# Altium project PCB_Project.PrjPcb (part 1 of 2)
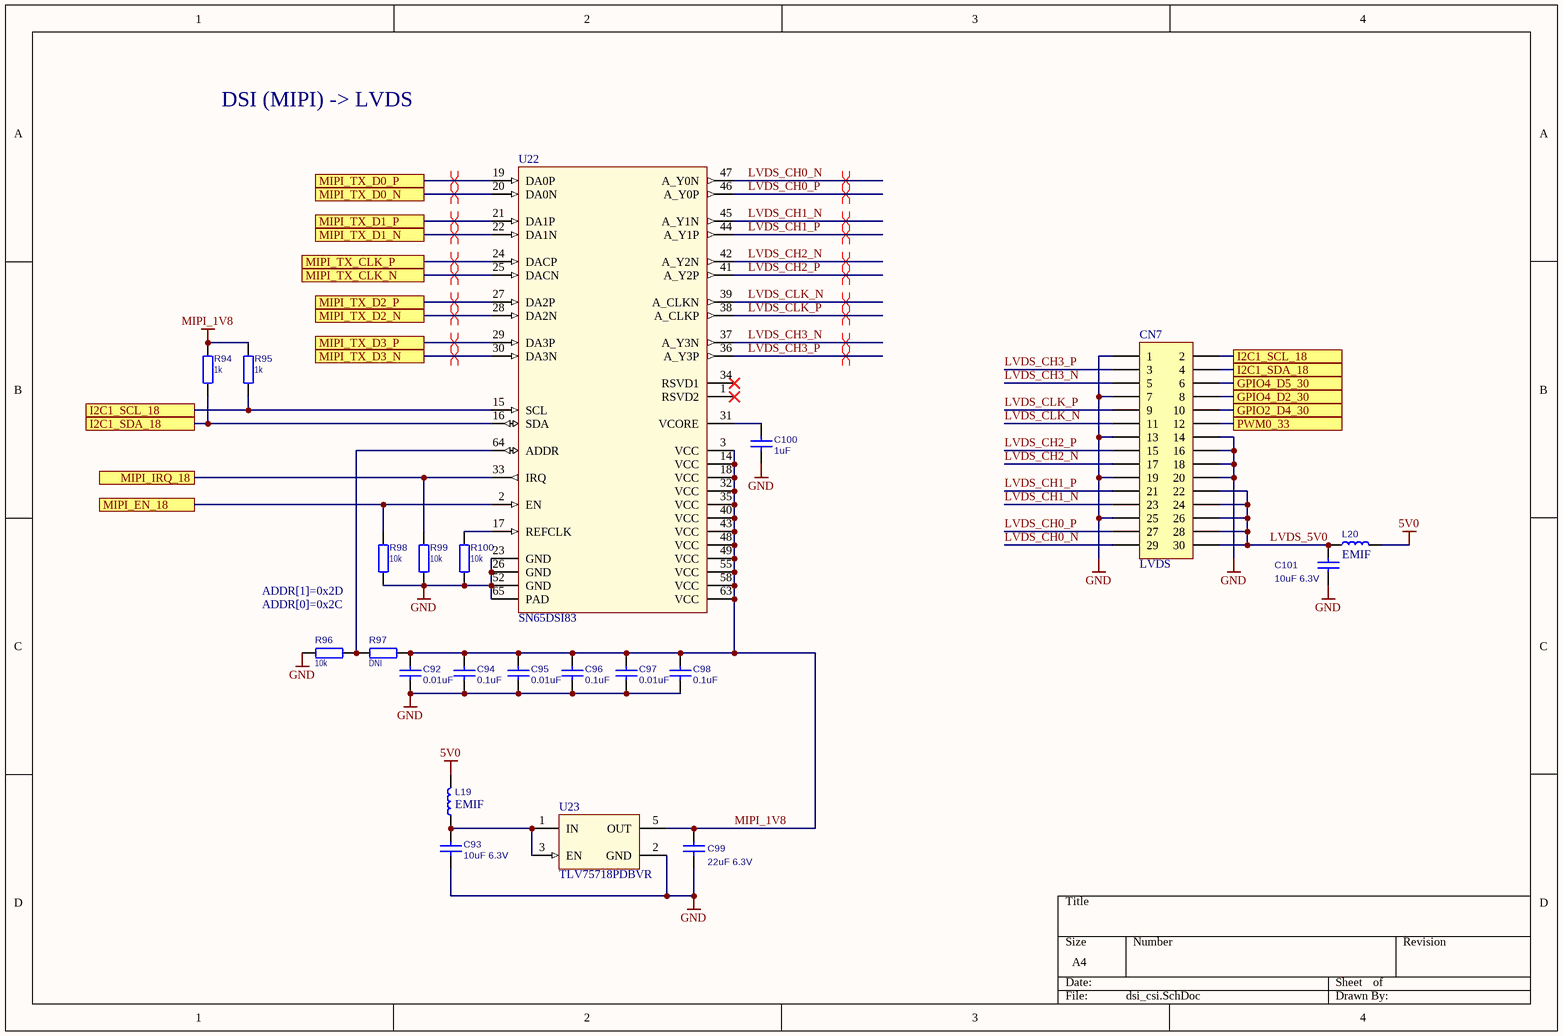
[diagram p0: dsi_csi.SchDoc]
10 sheets, 297 parts. Net scope: flat (ports and power ports of the same name join across sheets).
Board file: PCB.PcbDoc
Sheets:
  dsi_csi.SchDoc
  sdcard.SchDoc
  sensors.SchDoc
  audio.SchDoc
  connectivity.SchDoc
  usb.SchDoc
  debug.SchDoc
  hdmi.SchDoc
  power.SchDoc
  x3399.SchDoc

## Sheet dsi_csi.SchDoc
size A4

### Parts
C92  value 0.01uF  [C0603]  (hidden comment: CL10B103KB8NNNC)
C93  value 10uF 6.3V  [C0603]  (hidden comment: CC0603MRX5R5BB106)
C94  value 0.1uF  [C0603]  (hidden comment: C1608X7R1H104K080AA)
C95  value 0.01uF  [C0603]  (hidden comment: CL10B103KB8NNNC)
C96  value 0.1uF  [C0603]  (hidden comment: C1608X7R1H104K080AA)
C97  value 0.01uF  [C0603]  (hidden comment: CL10B103KB8NNNC)
C98  value 0.1uF  [C0603]  (hidden comment: C1608X7R1H104K080AA)
C99  value 22uF 6.3V  [C0805]  (hidden comment: CL21A226MQQNNNE)
C100  value 1uF  [C0603]  (hidden comment: GRM188R61H105KAALD)
C101  value 10uF 6.3V  [C0603]  (hidden comment: CC0603MRX5R5BB106)
CN7  LVDS  [DF13EA-30DP-1.25V]
L19  value EMIF  [IND0603]  (hidden comment: BLM18AG102SN1D)
L20  value EMIF  [IND0805]  (hidden comment: BLM21PG221SN1D)
R94  1k  [R0603]
R95  1k  [R0603]
R96  10k  [R0603]
R97  DNI  [R0603]
R98  10k  [R0603]
R99  10k  [R0603]
R100  10k  [R0603]
U22  SN65DSI83  [HPM064_N]
U23  TLV75718PDBVR  [SOT-23-5]

### Ports
GPIO2_D4_30, GPIO4_D2_30, GPIO4_D5_30, I2C1_SCL_18, I2C1_SDA_18, MIPI_EN_18, MIPI_IRQ_18, MIPI_TX_CLK_N, MIPI_TX_CLK_P, MIPI_TX_D0_N, MIPI_TX_D0_P, MIPI_TX_D1_N, MIPI_TX_D1_P, MIPI_TX_D2_N, MIPI_TX_D2_P, MIPI_TX_D3_N, MIPI_TX_D3_P, PWM0_33

### Nets
5V0: L19.2 L20.1
GND: C92.2 C93.2 C94.1 C95.2 C96.1 C97.2 C98.1 C99.1 C100.1 C101.2 CN7.1 CN7.7 CN7.13 CN7.14 CN7.16 CN7.18 CN7.19 CN7.20 CN7.25 R96.1 R98.1 R99.1 R100.1 U22.23(GND) U22.26(GND) U22.52(GND) U22.65(PAD) U23.2(GND)
MIPI_1V8: C92.1 C94.2 C95.1 C96.2 C97.1 C98.2 C99.2 R94.1 R95.1 R97.2 U22.3(VCC) U22.14(VCC) U22.18(VCC) U22.32(VCC) U22.35(VCC) U22.40(VCC) U22.43(VCC) U22.48(VCC) U22.49(VCC) U22.55(VCC) U22.58(VCC) U22.63(VCC) U23.5(OUT)
GPIO2_D4_30: CN7.10 ; port GPIO2_D4_30
GPIO4_D2_30: CN7.8 ; port GPIO4_D2_30
GPIO4_D5_30: CN7.6 ; port GPIO4_D5_30
I2C1_SCL_18: CN7.2 R95.2 U22.15(SCL) ; port I2C1_SCL_18
I2C1_SDA_18: CN7.4 R94.2 U22.16(SDA) ; port I2C1_SDA_18
LVDS_5V0: C101.1 CN7.22 CN7.24 CN7.26 CN7.28 CN7.30 L20.2
LVDS_CH0_N: CN7.29 U22.47(A_Y0N)
LVDS_CH0_P: CN7.27 U22.46(A_Y0P)
LVDS_CH1_N: CN7.23 U22.45(A_Y1N)
LVDS_CH1_P: CN7.21 U22.44(A_Y1P)
LVDS_CH2_N: CN7.17 U22.42(A_Y2N)
LVDS_CH2_P: CN7.15 U22.41(A_Y2P)
LVDS_CH3_N: CN7.5 U22.37(A_Y3N)
LVDS_CH3_P: CN7.3 U22.36(A_Y3P)
LVDS_CLK_N: CN7.11 U22.39(A_CLKN)
LVDS_CLK_P: CN7.9 U22.38(A_CLKP)
MIPI_EN_18: R98.2 U22.2(EN) ; port MIPI_EN_18
MIPI_IRQ_18: R99.2 U22.33(IRQ) ; port MIPI_IRQ_18
MIPI_TX_CLK_N: U22.25(DACN) ; port MIPI_TX_CLK_N
MIPI_TX_CLK_P: U22.24(DACP) ; port MIPI_TX_CLK_P
MIPI_TX_D0_N: U22.20(DA0N) ; port MIPI_TX_D0_N
MIPI_TX_D0_P: U22.19(DA0P) ; port MIPI_TX_D0_P
MIPI_TX_D1_N: U22.22(DA1N) ; port MIPI_TX_D1_N
MIPI_TX_D1_P: U22.21(DA1P) ; port MIPI_TX_D1_P
MIPI_TX_D2_N: U22.28(DA2N) ; port MIPI_TX_D2_N
MIPI_TX_D2_P: U22.27(DA2P) ; port MIPI_TX_D2_P
MIPI_TX_D3_N: U22.30(DA3N) ; port MIPI_TX_D3_N
MIPI_TX_D3_P: U22.29(DA3P) ; port MIPI_TX_D3_P
PWM0_33: CN7.12 ; port PWM0_33
NetC93_1: C93.1 L19.1 U23.1(IN) U23.3(EN)
NetC100_2: C100.2 U22.31(VCORE)
NetR96_2: R96.2 R97.1 U22.64(ADDR)
NetR100_2: R100.2 U22.17(REFCLK)

Not connected (* = marked no-connect by the designer): U22 1(RSVD2)* 34(RSVD1)*

### Layout directives
differential pair: LVDS_CH0_N, LVDS_CH0_P, LVDS_CH1_N, LVDS_CH1_P, LVDS_CH2_N, LVDS_CH2_P, LVDS_CH3_N, LVDS_CH3_P, LVDS_CLK_N, LVDS_CLK_P, MIPI_TX_CLK_N, MIPI_TX_CLK_P, MIPI_TX_D0_N, MIPI_TX_D0_P, MIPI_TX_D1_N, MIPI_TX_D1_P, MIPI_TX_D2_N, MIPI_TX_D2_P, MIPI_TX_D3_N, MIPI_TX_D3_P

### Notes on the sheet
- DSI (MIPI) -> LVDS
- ADDR[1]=0x2D
- ADDR[0]=0x2C

### Library data of the parts
C92-C101 = CAP_NPOL
CN7 = HDR 15X2: Header, 15-Pin, Dual row; LatestRevisionDate: 17-Jul-2002; LatestRevisionNote: Re-released for DXP Platform.; Publisher: Altium Limited
L19 L20 = IND_WO_IRON
R94-R100 = RESISTOR: RES
  R94 R95: Value: 1k
  R96 R98-R100: Value: 10k
  R97: Value: DNI
U22 = SN65DSI83: Single-Channel MIPI® DSI to Single-Link LVDS Bridge; value: SN65DSI83
U23 = TLV733P: Capacitor-Free, 300-mA, Low-Dropout Regulator with Foldback Current Limit for Portable Devices; value: TLV733P

## Sheet sdcard.SchDoc
size A4
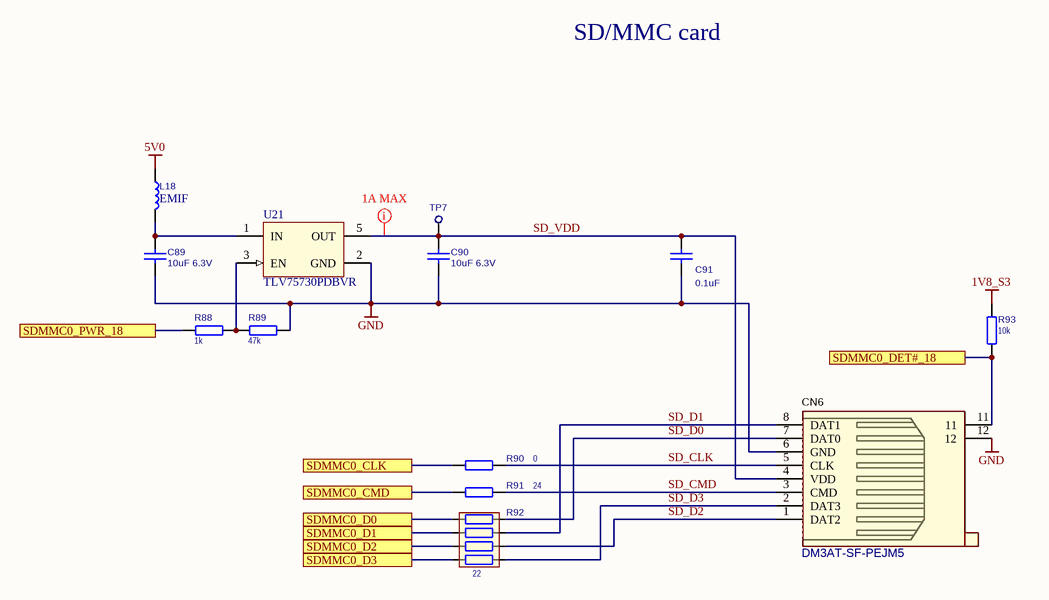
[diagram p1: sdcard.SchDoc]

### Parts
C89  value 10uF 6.3V  [C0603]  (hidden comment: CC0603MRX5R5BB106)
C90  value 10uF 6.3V  [C0603]  (hidden comment: CC0603MRX5R5BB106)
C91  value 0.1uF  [C0603]  (hidden comment: C1608X7R1H104K080AA)
CN6  DM3AT-SF-PEJM5  [mSD_TF_push]
L18  value EMIF  [IND0603]  (hidden comment: BLM18AG102SN1D)
R88  1k  [R0603]
R89  47k  [R0603]
R90  0  [R0603]
R91  value 24  [R0603]  (hidden comment: 22)
R92  value 22  [R0804X4]  (hidden comment: TC124-JR-0722RL)
R93  10k  [R0603]
TP7  TEST-POINT  [PAD]  (value not drawn)
U21  TLV75730PDBVR  [SOT-23-5]

### Ports
SDMMC0_CLK, SDMMC0_CMD, SDMMC0_D0, SDMMC0_D1, SDMMC0_D2, SDMMC0_D3, SDMMC0_DET#_18, SDMMC0_PWR_18

### Nets
1V8_S3: R93.2
5V0: L18.1
GND: C89.2 C90.2 C91.1 CN6.6(GND) CN6.12 R89.2 U21.2(GND)
SD_CLK: CN6.5(CLK) R90.1
SD_CMD: CN6.3(CMD) R91.1
SD_D0: CN6.7(DAT0) R92.2
SD_D1: CN6.8(DAT1) R92.4
SD_D2: CN6.1(DAT2) R92.6
SD_D3: CN6.2(DAT3) R92.8
SD_VDD: C90.1 C91.2 CN6.4(VDD) TP7.1 U21.5(OUT)
SDMMC0_CLK: R90.2 ; port SDMMC0_CLK
SDMMC0_CMD: R91.2 ; port SDMMC0_CMD
SDMMC0_D0: R92.1 ; port SDMMC0_D0
SDMMC0_D1: R92.3 ; port SDMMC0_D1
SDMMC0_D2: R92.5 ; port SDMMC0_D2
SDMMC0_D3: R92.7 ; port SDMMC0_D3
SDMMC0_DET#_18: CN6.11 R93.1 ; port SDMMC0_DET#_18
SDMMC0_PWR_18: R88.1 ; port SDMMC0_PWR_18
NetC89_1: C89.1 L18.2 U21.1(IN)
NetR88_2: R88.2 R89.1 U21.3(EN)

### Layout directives
mark named 1A MAX: SD_VDD

### Notes on the sheet
- SD/MMC card

### Library data of the parts
C89-C91 = CAP_NPOL
CN6 = uSD card socket: In Stock: 0; Type: Connectors; Price: 0.00; Supplier: Rusar; Supplier PN: xxx
L18 = IND_WO_IRON
R88-R91 R93 = RESISTOR: RES
  R88: Value: 1k
  R89: Value: 47k
  R90: Value: 0
  R93: Value: 10k
R92 = ARRAY
TP7 = TEST-POINT: PCB terminal block; Value: *
U21 = TLV733P: as U23 on sheet dsi_csi; value: TLV733P

## Sheet sensors.SchDoc
size A4
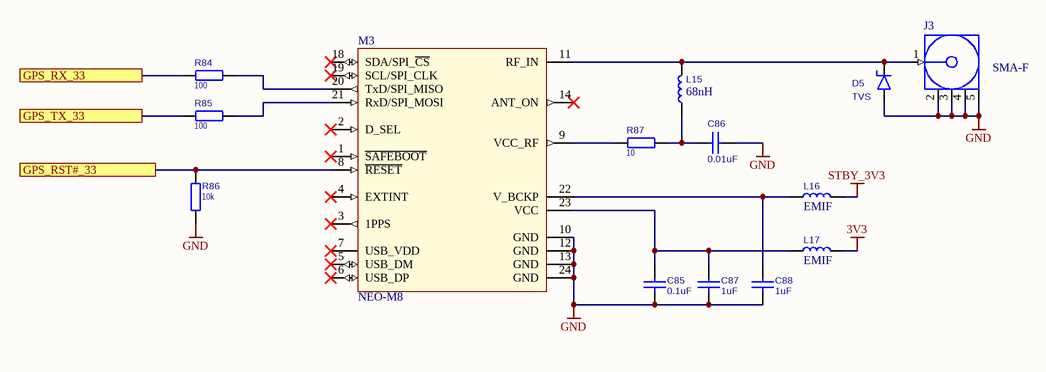
[diagram p2: sensors.SchDoc]

### Parts
C85  value 0.1uF  [C0603]  (hidden comment: C1608X7R1H104K080AA)
C86  value 0.01uF  [C0603]  (hidden comment: CL10B103KB8NNNC)
C87  value 1uF  [C0603]  (hidden comment: GRM188R61H105KAALD)
C88  value 1uF  [C0603]  (hidden comment: GRM188R61H105KAALD)
D5  value TVS  [SOD-323]  (hidden comment: CDSOD323-T05LC)
J3  value SMA-F  [MCX5.08-H5]  (hidden comment: CON SMA-F S-037-TGG R/A PCB)
L15  value 68nH  [IND0603]  (hidden comment: CLH1608T-68NJ-S)
L16  value EMIF  [IND0603]  (hidden comment: BLM18AG102SN1D)
L17  value EMIF  [IND0805]  (hidden comment: BLM21PG221SN1D)
M3  NEO-M8  [NEO-M8N]
R84  100  [R0603]
R85  100  [R0603]
R86  10k  [R0603]
R87  10  [R0603]

### Ports
GPS_RST#_33, GPS_RX_33, GPS_TX_33

### Nets
3V3: L17.1
GND: C85.2 C86.1 C87.1 C88.1 D5.1(A) J3.2(GND) J3.3(GND) J3.4(GND) J3.5(GND) M3.10(GND) M3.12(GND) M3.13(GND) M3.24(GND) R86.2
STBY_3V3: L16.2
GPS_RST#_33: M3.8(~{RESET}) R86.1 ; port GPS_RST#_33
GPS_RX_33: R84.1 ; port GPS_RX_33
GPS_TX_33: R85.1 ; port GPS_TX_33
NetC85_1: C85.1 C87.2 L17.2 M3.23(VCC)
NetC86_2: C86.2 L15.1 R87.2
NetC88_2: C88.2 L16.1 M3.22(V_BCKP)
NetD5_2: D5.2(K) J3.1(Signal) L15.2 M3.11(RF_IN)
NetM3_9: M3.9(VCC_RF) R87.1
NetM3_20: M3.20(TxD/SPI_MISO) R84.2
NetM3_21: M3.21(RxD/SPI_MOSI) R85.2

Not connected (* = marked no-connect by the designer): M3 1(~{SAFEBOOT})* 2(D_SEL)* 3(1PPS)* 4(EXTINT)* 5(USB_DM)* 6(USB_DP)* 7(USB_VDD)* 14(ANT_ON)* 18(SDA/SPI_~{CS})* 19(SCL/SPI_CLK)*

### Library data of the parts
C85-C88 = CAP_NPOL
D5 = ZENNER_1: TVS Diode
J3 = COAX-F: RF Coaxial PCB Connector, MCX; Thru-Hole, Right-Angle Mount Socket, Blunt Post Terminal, 50 Ohm Impedance; PCB_Layout: Complies with manufacturer's recommendation.; DrillSize: Corresponds to nominal value.; Published: 15-Jul-2004; LatestRevisionDate: 15-Jul-2004; LatestRevisionNote: Component Replaced.; DatasheetDocument: 30-May-2003; PackageDocument: 04-Jul-1999; PackageReference: 919-119J-51AX; Publisher: Altium Limited; ComponentLink1Description: Manufacturer Link; ComponentLink1URL: http://www.amphenolrf.com/
L15-L17 = IND_WO_IRON
M3 = NEO-M8: NEO-M8 concurrent GNSS modules; value: NEO-M8
R84-R87 = RESISTOR: RES
  R84 R85: Value: 100
  R86: Value: 10k
  R87: Value: 10

## Sheet audio.SchDoc
size A3
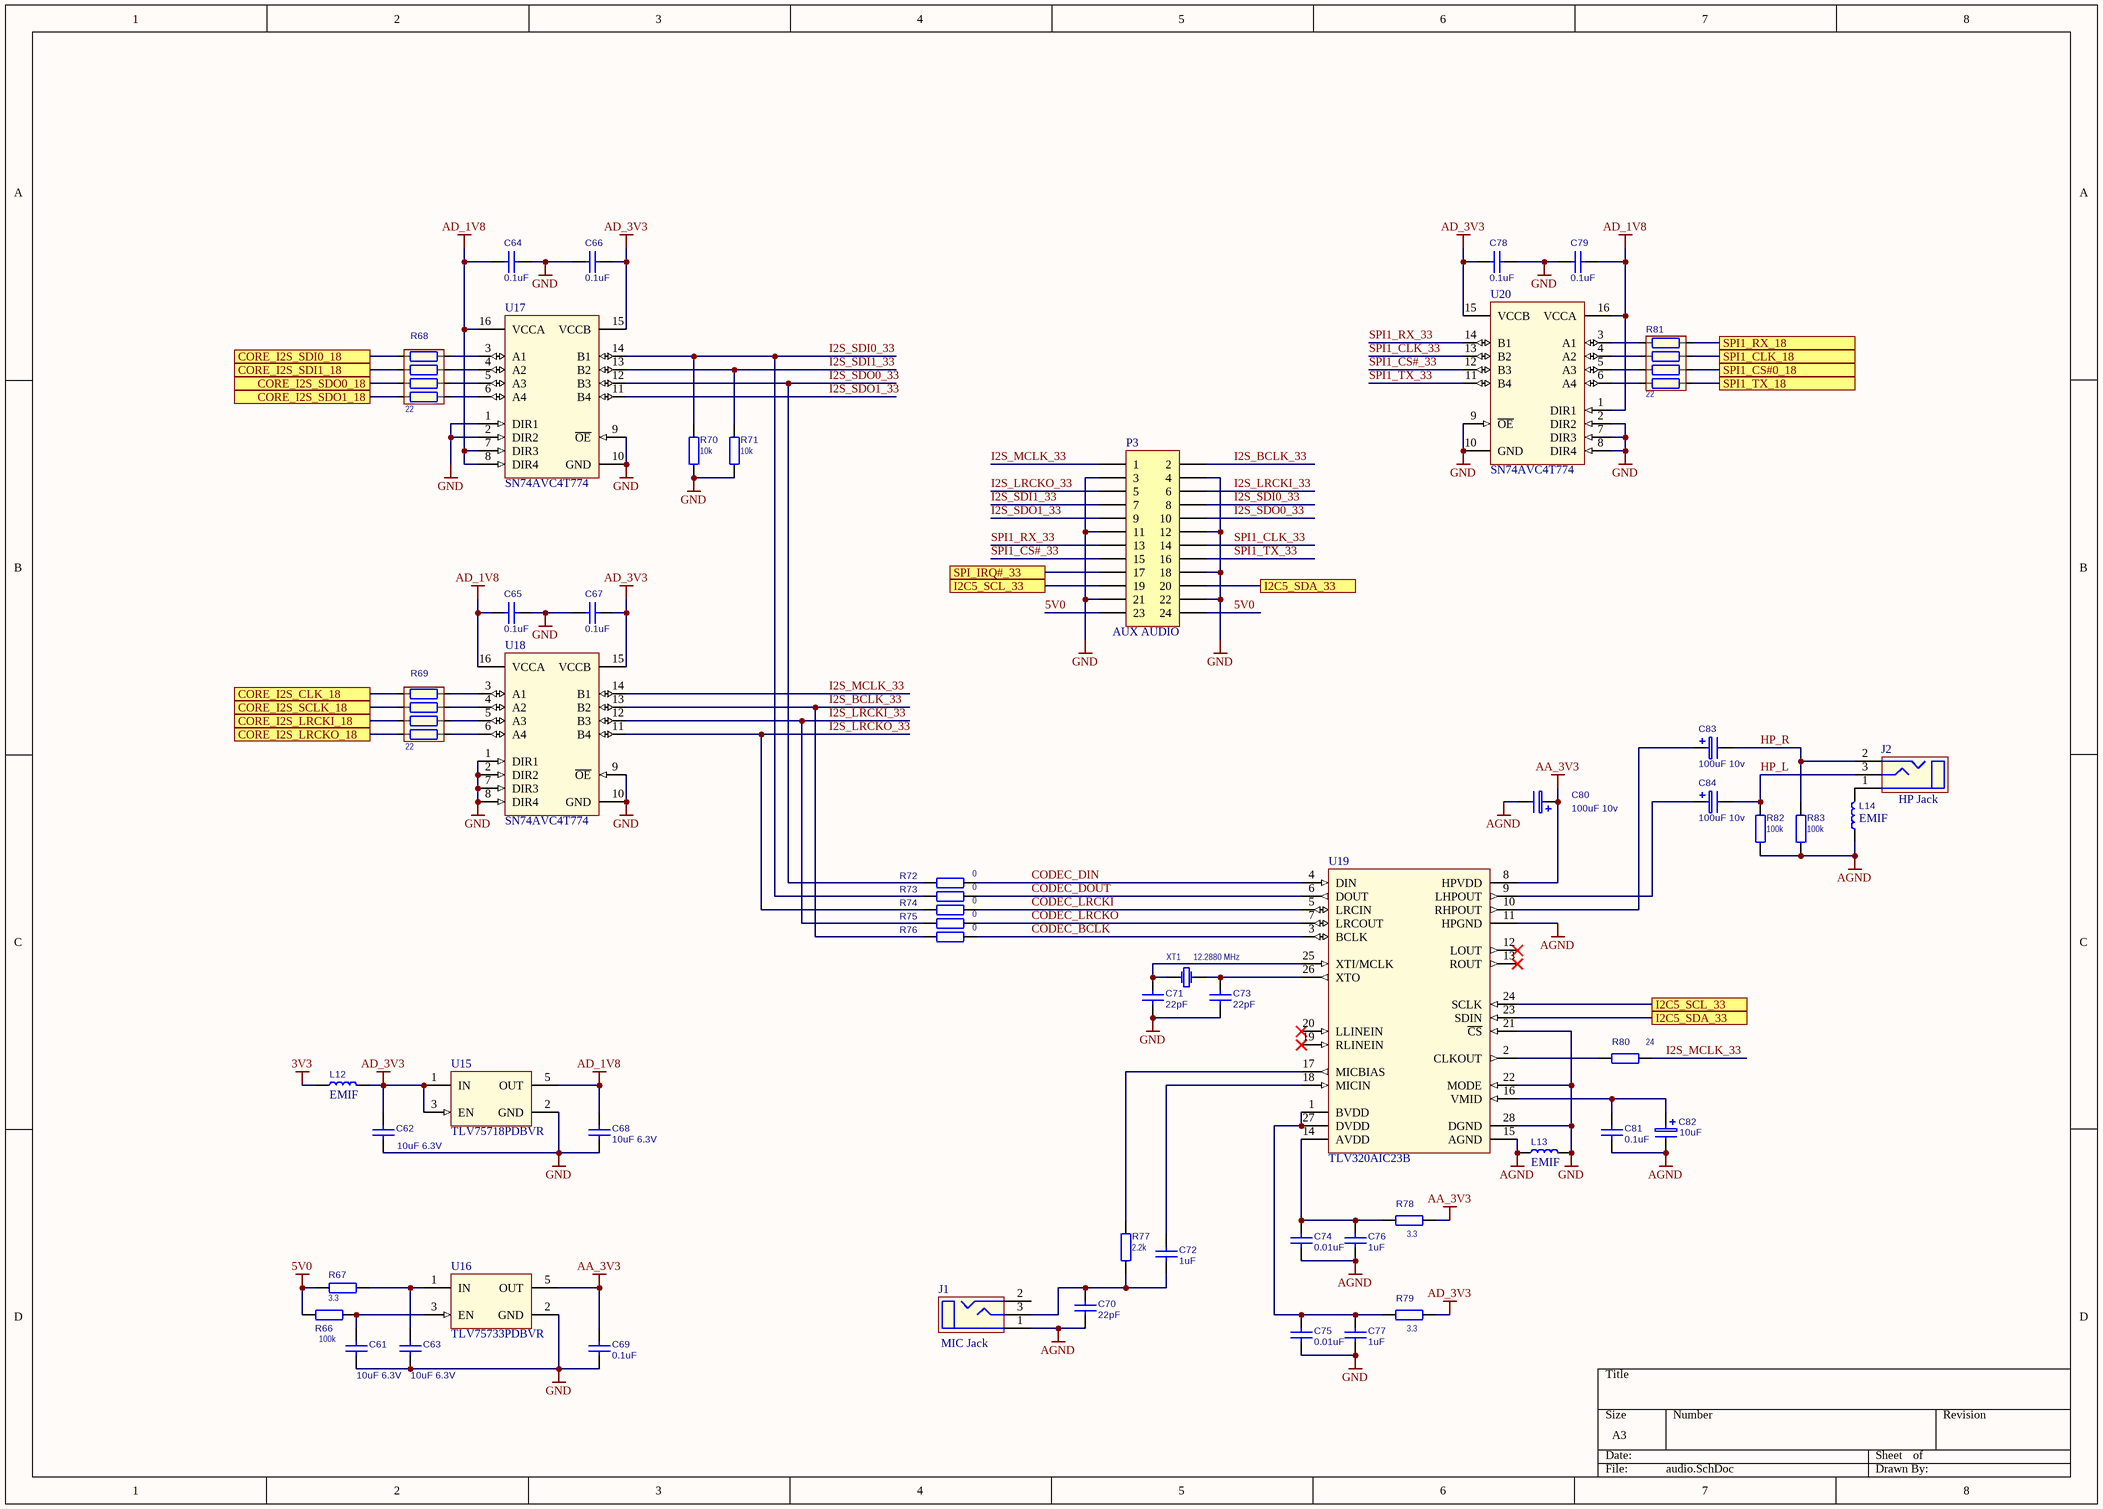
[diagram p3: audio.SchDoc]

### Parts
C61  value 10uF 6.3V  [C0603]  (hidden comment: CC0603MRX5R5BB106)
C62  value 10uF 6.3V  [C0603]  (hidden comment: CC0603MRX5R5BB106)
C63  value 10uF 6.3V  [C0603]  (hidden comment: CC0603MRX5R5BB106)
C64  value 0.1uF  [C0603]  (hidden comment: C1608X7R1H104K080AA)
C65  value 0.1uF  [C0603]  (hidden comment: C1608X7R1H104K080AA)
C66  value 0.1uF  [C0603]  (hidden comment: C1608X7R1H104K080AA)
C67  value 0.1uF  [C0603]  (hidden comment: C1608X7R1H104K080AA)
C68  value 10uF 6.3V  [C0603]  (hidden comment: CC0603MRX5R5BB106)
C69  value 0.1uF  [C0603]  (hidden comment: C1608X7R1H104K080AA)
C70  22pF  [C0603]
C71  22pF  [C0603]
C72  value 1uF  [C0603]  (hidden comment: GRM188R61H105KAALD)
C73  22pF  [C0603]
C74  value 0.01uF  [C0603]  (hidden comment: C1608X7R1H104K080AA)
C75  value 0.01uF  [C0603]  (hidden comment: C1608X7R1H104K080AA)
C76  value 1uF  [C0603]  (hidden comment: GRM188R61H105KAALD)
C77  value 1uF  [C0603]  (hidden comment: GRM188R61H105KAALD)
C78  value 0.1uF  [C0603]  (hidden comment: C1608X7R1H104K080AA)
C79  value 0.1uF  [C0603]  (hidden comment: C1608X7R1H104K080AA)
C80  value 100uF 10v  [R06H11]  (hidden comment: SH010M0100B2F-0511)
C81  value 0.1uF  [C0603]  (hidden comment: C1608X7R1H104K080AA)
C82  value 10uF  [TANTAL-A-1206]  (hidden comment: CAP_POL)
C83  value 100uF 10v  [R06H11]  (hidden comment: SH010M0100B2F-0511)
C84  value 100uF 10v  [R06H11]  (hidden comment: SH010M0100B2F-0511)
J1  value MIC Jack  [AUB-13]  (hidden comment: AUB-13)
J2  value HP Jack  [AUB-13]  (hidden comment: AUB-13)
L12  value EMIF  [IND0805]  (hidden comment: BLM21PG221SN1D)
L13  value EMIF  [IND0805]  (hidden comment: BLM21PG221SN1D)
L14  value EMIF  [IND0805]  (hidden comment: BLM21PG221SN1D)
P3  AUX AUDIO  [PLD-12]
R66  100k  [R0603]
R67  3.3  [R1206]
R68  value 22  [R0804X4]  (hidden comment: TC124-JR-0722RL)
R69  value 22  [R0804X4]  (hidden comment: TC124-JR-0722RL)
R70  10k  [R0603]
R71  10k  [R0603]
R72  0  [R0603]
R73  0  [R0603]
R74  0  [R0603]
R75  0  [R0603]
R76  0  [R0603]
R77  2.2k  [R0603]
R78  3.3  [R1206]
R79  3.3  [R1206]
R80  value 24  [R0603]  (hidden comment: 22)
R81  value 22  [R0804X4]  (hidden comment: TC124-JR-0722RL)
R82  100k  [R0603]
R83  100k  [R0603]
U15  TLV75718PDBVR  [SOT-23-5]
U16  TLV75733PDBVR  [SOT-23-5]
U17  SN74AVC4T774  [TSSOP-16]
U18  SN74AVC4T774  [TSSOP-16]
U19  TLV320AIC23B  [TSSOP-28]
U20  SN74AVC4T774  [TSSOP-16]
XT1  value 12.2880 MHz  [HC-49/S]  (hidden comment: KX-3H 12.2880 MHz)

### Ports
CORE_I2S_CLK_18, CORE_I2S_LRCKI_18, CORE_I2S_LRCKO_18, CORE_I2S_SCLK_18, CORE_I2S_SDI0_18, CORE_I2S_SDI1_18, CORE_I2S_SDO0_18, CORE_I2S_SDO1_18, I2C5_SCL_33, I2C5_SDA_33, SPI1_CLK_18, SPI1_CS#0_18, SPI1_RX_18, SPI1_TX_18, SPI_IRQ#_33

### Nets
3V3: L12.2
5V0: P3.23 P3.24 R66.1 R67.2
AA_3V3: C69.1 C80.1(+) R78.1 U16.5(OUT) U19.8(HPVDD)
AD_1V8: C64.2 C65.2 C68.1 C79.2 U15.5(OUT) U17.7(DIR3) U17.8(DIR4) U17.16(VCCA) U18.16(VCCA) U20.1(DIR1) U20.16(VCCA)
AD_3V3: C62.1 C66.1 C67.1 C78.1 L12.1 R79.1 U15.1(IN) U15.3(EN) U17.15(VCCB) U18.15(VCCB) U20.15(VCCB)
AGND: C70.2 C74.2 C76.1 C80.2(-) C81.2 C82.2(-) J1.1(C) L13.2 L14.2 R82.2 R83.2 U19.11(HPGND) U19.15(AGND)
GND: C61.2 C62.2 C63.2 C64.1 C65.1 C66.2 C67.2 C68.2 C69.2 C71.1 C73.1 C75.2 C77.1 C78.2 C79.1 L13.1 P3.3 P3.4 P3.11 P3.12 P3.18 P3.21 P3.22 R70.2 R71.2 U15.2(GND) U16.2(GND) U17.1(DIR1) U17.2(DIR2) U17.9(~{OE}) U17.10(GND) U18.1(DIR1) U18.2(DIR2) U18.7(DIR3) U18.8(DIR4) U18.9(~{OE}) U18.10(GND) U19.21(~{CS}) U19.22(MODE) U19.28(DGND) U20.2(DIR2) U20.7(DIR3) U20.8(DIR4) U20.9(~{OE}) U20.10(GND)
CODEC_BCLK: R76.2 U19.3(BCLK)
CODEC_DIN: R72.2 U19.4(DIN)
CODEC_DOUT: R73.2 U19.6(DOUT)
CODEC_LRCKI: R74.2 U19.5(LRCIN)
CODEC_LRCKO: R75.2 U19.7(LRCOUT)
CORE_I2S_CLK_18: R69.1 ; port CORE_I2S_CLK_18
CORE_I2S_LRCKI_18: R69.5 ; port CORE_I2S_LRCKI_18
CORE_I2S_LRCKO_18: R69.7 ; port CORE_I2S_LRCKO_18
CORE_I2S_SCLK_18: R69.3 ; port CORE_I2S_SCLK_18
CORE_I2S_SDI0_18: R68.1 ; port CORE_I2S_SDI0_18
CORE_I2S_SDI1_18: R68.3 ; port CORE_I2S_SDI1_18
CORE_I2S_SDO0_18: R68.5 ; port CORE_I2S_SDO0_18
CORE_I2S_SDO1_18: R68.7 ; port CORE_I2S_SDO1_18
HP_L: C84.2(-) J2.3(L) R82.1
HP_R: C83.2(-) J2.2(R) R83.1
I2C5_SCL_33: P3.19 U19.24(SCLK) ; port I2C5_SCL_33
I2C5_SDA_33: P3.20 U19.23(SDIN) ; port I2C5_SDA_33
I2S_BCLK_33: P3.2 R76.1 U18.13(B2)
I2S_LRCKI_33: P3.6 R75.1 U18.12(B3)
I2S_LRCKO_33: P3.5 R74.1 U18.11(B4)
I2S_MCLK_33: P3.1 R80.1 U18.14(B1)
I2S_SDI0_33: P3.8 R70.1 R73.1 U17.14(B1)
I2S_SDI1_33: P3.7 R71.1 U17.13(B2)
I2S_SDO0_33: P3.10 R72.1 U17.12(B3)
I2S_SDO1_33: P3.9 U17.11(B4)
SPI1_CLK_18: R81.3 ; port SPI1_CLK_18
SPI1_CLK_33: P3.14 U20.13(B2)
SPI1_CS#0_18: R81.5 ; port SPI1_CS#0_18
SPI1_CS#_33: P3.15 U20.12(B3)
SPI1_RX_18: R81.1 ; port SPI1_RX_18
SPI1_RX_33: P3.13 U20.14(B1)
SPI1_TX_18: R81.7 ; port SPI1_TX_18
SPI1_TX_33: P3.16 U20.11(B4)
SPI_IRQ#_33: P3.17 ; port SPI_IRQ#_33
NetC61_1: C61.1 R66.2 U16.3(EN)
NetC63_1: C63.1 R67.1 U16.1(IN)
NetC70_1: C70.1 C72.2 J1.3(L) R77.2
NetC71_2: C71.2 U19.25(XTI/MCLK) XT1.1
NetC72_1: C72.1 U19.18(MICIN)
NetC73_2: C73.2 U19.26(XTO) XT1.2
NetC74_1: C74.1 C76.2 R78.2 U19.14(AVDD)
NetC75_1: C75.1 C77.2 R79.2 U19.1(BVDD) U19.27(DVDD)
NetC81_1: C81.1 C82.1(+) U19.16(VMID)
NetC83_1: C83.1(+) U19.10(RHPOUT)
NetC84_1: C84.1(+) U19.9(LHPOUT)
NetJ2_1: J2.1(C) L14.1
NetR68_2: R68.2 U17.3(A1)
NetR68_4: R68.4 U17.4(A2)
NetR68_6: R68.6 U17.5(A3)
NetR68_8: R68.8 U17.6(A4)
NetR69_2: R69.2 U18.3(A1)
NetR69_4: R69.4 U18.4(A2)
NetR69_6: R69.6 U18.5(A3)
NetR69_8: R69.8 U18.6(A4)
NetR77_1: R77.1 U19.17(MICBIAS)
NetR80_2: R80.2 U19.2(CLKOUT)
NetR81_2: R81.2 U20.3(A1)
NetR81_4: R81.4 U20.4(A2)
NetR81_6: R81.6 U20.5(A3)
NetR81_8: R81.8 U20.6(A4)

Not connected (* = marked no-connect by the designer): J1 2(R); U19 12(LOUT)* 13(ROUT)* 19(RLINEIN)* 20(LLINEIN)*

### Library data of the parts
C61-C79 C81 = CAP_NPOL
  C70 C71 C73: Value: 22pF
C80 C83 C84 = CAP_POL
J1 J2 = PhoneJackStereo: Phonejack Stereo
L12-L14 = IND_WO_IRON
P3 = HDR 12X2: Header, 12-Pin, Dual row; LatestRevisionDate: 17-Jul-2002; LatestRevisionNote: Re-released for DXP Platform.; Publisher: Altium Limited
R66 R67 R70-R80 R82 R83 = RESISTOR: RES
  R66 R82 R83: Value: 100k
  R67 R78 R79: Value: 3.3
  R70 R71: Value: 10k
  R72-R76: Value: 0
  R77: Value: 2.2k
R68 R69 R81 = ARRAY
U15 U16 = TLV733P: as U23 on sheet dsi_csi; value: TLV733P
U17 U18 U20 = SN74AVC4T774: 4-Bit Dual-Supply Bus Transceiver With Configurable Voltage-Level Shifting and 3-State Outputs; value: SN74AVC4T774
U19 = TLV320AIC23: Stereo Audio CODEC
XT1 = XTAL

## Sheet connectivity.SchDoc
size A4
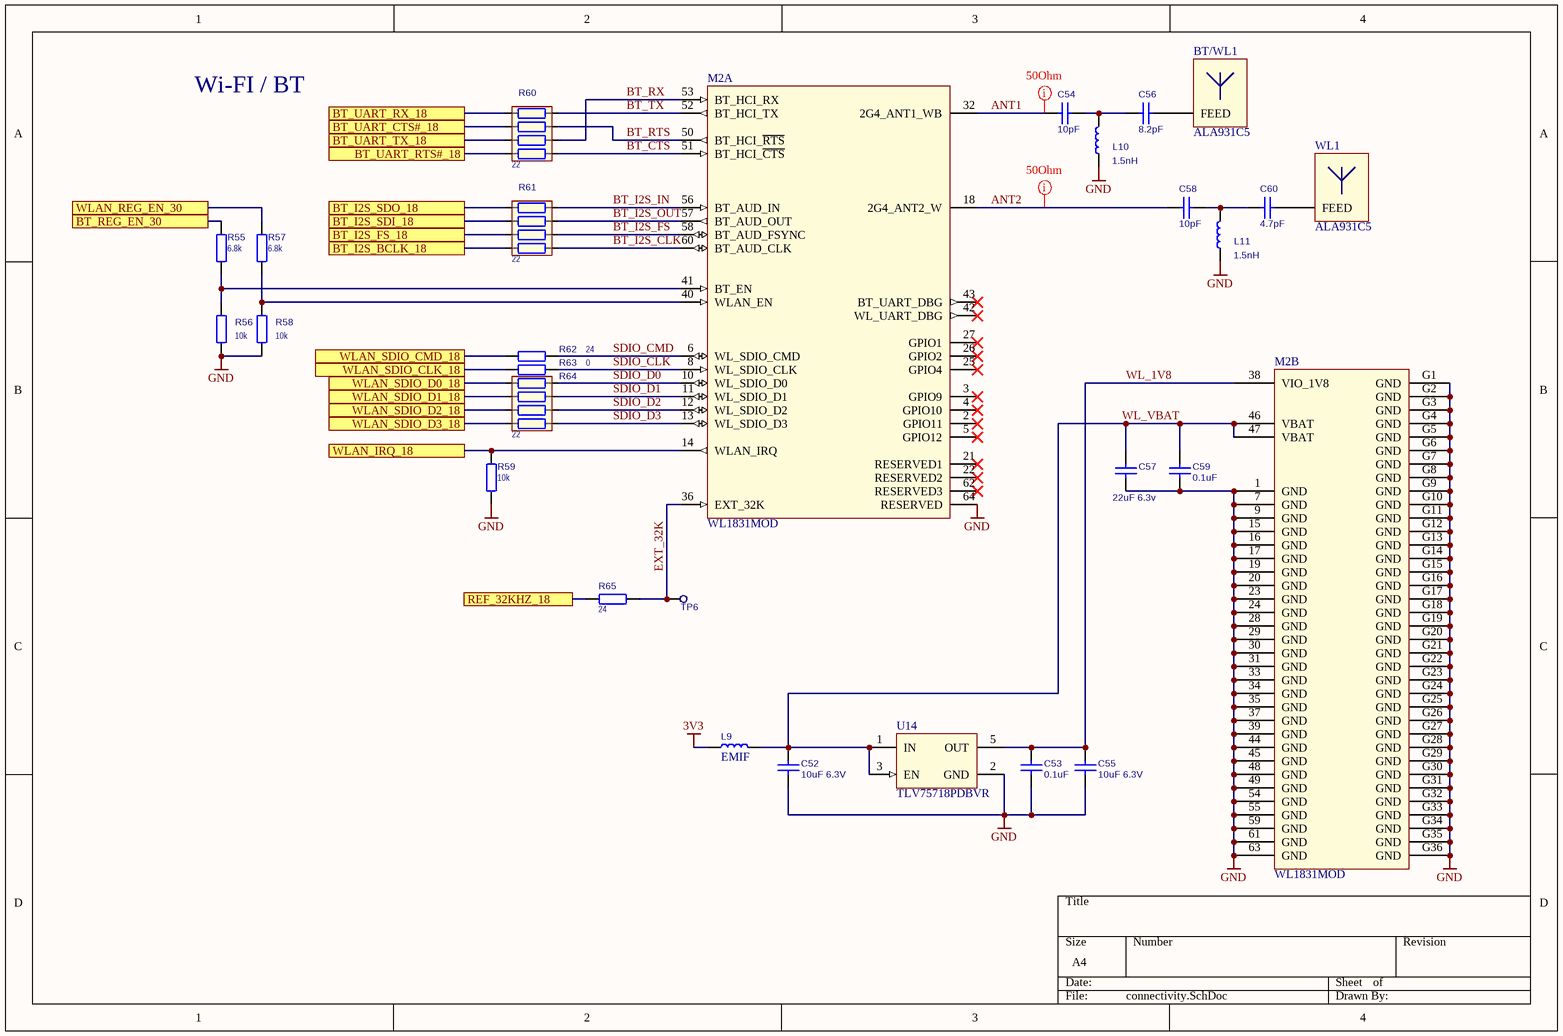
[diagram p4: connectivity.SchDoc]

### Parts
BT/WL1  ALA931C5  [9x3x1.2]
C52  value 10uF 6.3V  [C0603]  (hidden comment: CC0603MRX5R5BB106)
C53  value 0.1uF  [C0603]  (hidden comment: C1608X7R1H104K080AA)
C54  value 10pF  [C0603]  (hidden comment: CL10C100JB8NNNC)
C55  value 10uF 6.3V  [C0603]  (hidden comment: CC0603MRX5R5BB106)
C56  value 8.2pF  [C0603]  (hidden comment: CL10C8R2CB8NNNC)
C57  value 22uF 6.3v  [C0805]  (hidden comment: CL21A226MQQNNNE)
C58  value 10pF  [C0603]  (hidden comment: CL10C100JB8NNNC)
C59  value 0.1uF  [C0603]  (hidden comment: C1608X7R1H104K080AA)
C60  value 4.7pF  [C0603]  (hidden comment: CC0603CRNPO9BN4R7)
L9  value EMIF  [IND0805]  (hidden comment: BLM21PG221SN1D)
L10  1.5nH  [IND0603]
L11  1.5nH  [IND0603]
M2  WL1831MOD  [E-13.4X13.3-N100_0.75-TOP]  (parts A,B of 2)
R55  6.8k  [R0603]
R56  10k  [R0603]
R57  6.8k  [R0603]
R58  10k  [R0603]
R59  10k  [R0603]
R60  value 22  [R0804X4]  (hidden comment: TC124-JR-0722RL)
R61  value 22  [R0804X4]  (hidden comment: TC124-JR-0722RL)
R62  value 24  [R0603]  (hidden comment: 22)
R63  0  [R0603]
R64  value 22  [R0804X4]  (hidden comment: TC124-JR-0722RL)
R65  value 24  [R0603]  (hidden comment: 22)
TP6  TEST-POINT  [PAD]  (value not drawn)
U14  TLV75718PDBVR  [SOT-23-5]
WL1  ALA931C5  [9x3x1.2]

### Ports
BT_I2S_BCLK_18, BT_I2S_FS_18, BT_I2S_SDI_18, BT_I2S_SDO_18, BT_REG_EN_30, BT_UART_CTS#_18, BT_UART_RTS#_18, BT_UART_RX_18, BT_UART_TX_18, REF_32KHZ_18, WLAN_IRQ_18, WLAN_REG_EN_30, WLAN_SDIO_CLK_18, WLAN_SDIO_CMD_18, WLAN_SDIO_D0_18, WLAN_SDIO_D1_18, WLAN_SDIO_D2_18, WLAN_SDIO_D3_18

### Nets
3V3: L9.2
GND: C52.2 C53.2 C55.2 C57.1 C59.1 L10.1 L11.1 M2.1(GND) M2.7(GND) M2.9(GND) M2.15(GND) M2.16(GND) M2.17(GND) M2.19(GND) M2.20(GND) M2.23(GND) M2.24(GND) M2.28(GND) M2.29(GND) M2.30(GND) M2.31(GND) M2.33(GND) M2.34(GND) M2.35(GND) M2.37(GND) M2.39(GND) M2.44(GND) M2.45(GND) M2.48(GND) M2.49(GND) M2.54(GND) M2.55(GND) M2.59(GND) M2.61(GND) M2.63(GND) M2.64(RESERVED) M2.G1(GND) M2.G2(GND) M2.G3(GND) M2.G4(GND) M2.G5(GND) M2.G6(GND) M2.G7(GND) M2.G8(GND) M2.G9(GND) M2.G10(GND) M2.G11(GND) M2.G12(GND) M2.G13(GND) M2.G14(GND) M2.G15(GND) M2.G16(GND) M2.G17(GND) M2.G18(GND) M2.G19(GND) M2.G20(GND) M2.G21(GND) M2.G22(GND) M2.G23(GND) M2.G24(GND) M2.G25(GND) M2.G26(GND) M2.G27(GND) M2.G28(GND) M2.G29(GND) M2.G30(GND) M2.G31(GND) M2.G32(GND) M2.G33(GND) M2.G34(GND) M2.G35(GND) M2.G36(GND) R56.2 R58.1 R59.1 U14.2(GND)
ANT1: C54.1 M2.32(2G4_ANT1_WB)
ANT2: C58.1 M2.18(2G4_ANT2_W)
BT_CTS: M2.51(BT_HCI_~{CTS}) R60.8
BT_I2S_BCLK_18: R61.7 ; port BT_I2S_BCLK_18
BT_I2S_CLK: M2.60(BT_AUD_CLK) R61.8
BT_I2S_FS: M2.58(BT_AUD_FSYNC) R61.6
BT_I2S_FS_18: R61.5 ; port BT_I2S_FS_18
BT_I2S_IN: M2.56(BT_AUD_IN) R61.2
BT_I2S_OUT: M2.57(BT_AUD_OUT) R61.4
BT_I2S_SDI_18: R61.3 ; port BT_I2S_SDI_18
BT_I2S_SDO_18: R61.1 ; port BT_I2S_SDO_18
BT_REG_EN_30: R55.1 ; port BT_REG_EN_30
BT_RTS: M2.50(BT_HCI_~{RTS}) R60.4
BT_RX: M2.53(BT_HCI_RX) R60.6
BT_TX: M2.52(BT_HCI_TX) R60.2
BT_UART_CTS#_18: R60.3 ; port BT_UART_CTS#_18
BT_UART_RTS#_18: R60.7 ; port BT_UART_RTS#_18
BT_UART_RX_18: R60.1 ; port BT_UART_RX_18
BT_UART_TX_18: R60.5 ; port BT_UART_TX_18
EXT_32K: M2.36(EXT_32K) R65.2 TP6.1
REF_32KHZ_18: R65.1 ; port REF_32KHZ_18
SDIO_CLK: M2.8(WL_SDIO_CLK) R63.1
SDIO_CMD: M2.6(WL_SDIO_CMD) R62.1
SDIO_D0: M2.10(WL_SDIO_D0) R64.1
SDIO_D1: M2.11(WL_SDIO_D1) R64.3
SDIO_D2: M2.12(WL_SDIO_D2) R64.5
SDIO_D3: M2.13(WL_SDIO_D3) R64.7
WL_1V8: C53.1 C55.1 M2.38(VIO_1V8) U14.5(OUT)
WL_VBAT: C52.1 C57.2 C59.2 L9.1 M2.46(VBAT) M2.47(VBAT) U14.1(IN) U14.3(EN)
WLAN_IRQ_18: M2.14(WLAN_IRQ) R59.2 ; port WLAN_IRQ_18
WLAN_REG_EN_30: R57.1 ; port WLAN_REG_EN_30
WLAN_SDIO_CLK_18: R63.2 ; port WLAN_SDIO_CLK_18
WLAN_SDIO_CMD_18: R62.2 ; port WLAN_SDIO_CMD_18
WLAN_SDIO_D0_18: R64.2 ; port WLAN_SDIO_D0_18
WLAN_SDIO_D1_18: R64.4 ; port WLAN_SDIO_D1_18
WLAN_SDIO_D2_18: R64.6 ; port WLAN_SDIO_D2_18
WLAN_SDIO_D3_18: R64.8 ; port WLAN_SDIO_D3_18
NetBT/WL1_1: BT/WL1.1(FEED) C56.2
NetC54_2: C54.2 C56.1 L10.2
NetC58_2: C58.2 C60.1 L11.2
NetC60_2: C60.2 WL1.1(FEED)
NetM2_40: M2.40(WLAN_EN) R57.2 R58.2
NetM2_41: M2.41(BT_EN) R55.2 R56.1

Not connected (* = marked no-connect by the designer): M2 2(GPIO11)* 3(GPIO9)* 4(GPIO10)* 5(GPIO12)* 21(RESERVED1)* 22(RESERVED2)* 25(GPIO4)* 26(GPIO2)* 27(GPIO1)* 42(WL_UART_DBG)* 43(BT_UART_DBG)* 62(RESERVED3)*

### Layout directives
rule Undefined: ANT1, ANT2

### Notes on the sheet
- Wi-FI / BT

### Library data of the parts
BT/WL1 WL1 = CHIP-ANT: Ceramic chip antenna; value: ALA931C5
C52-C60 = CAP_NPOL
L9 = IND_WO_IRON
L10 L11 = IND_WO_IRON: Value: CLH1608T-1N5S-S
M2 = WL18xxMOD
R55-R59 R62 R63 R65 = RESISTOR: RES
  R55 R57: Value: 6.8k
  R56 R58 R59: Value: 10k
  R63: Value: 0
R60 R61 R64 = ARRAY
TP6 = TEST-POINT: PCB terminal block; Value: *
U14 = TLV733P: as U23 on sheet dsi_csi; value: TLV733P

## Sheet usb.SchDoc
size A3
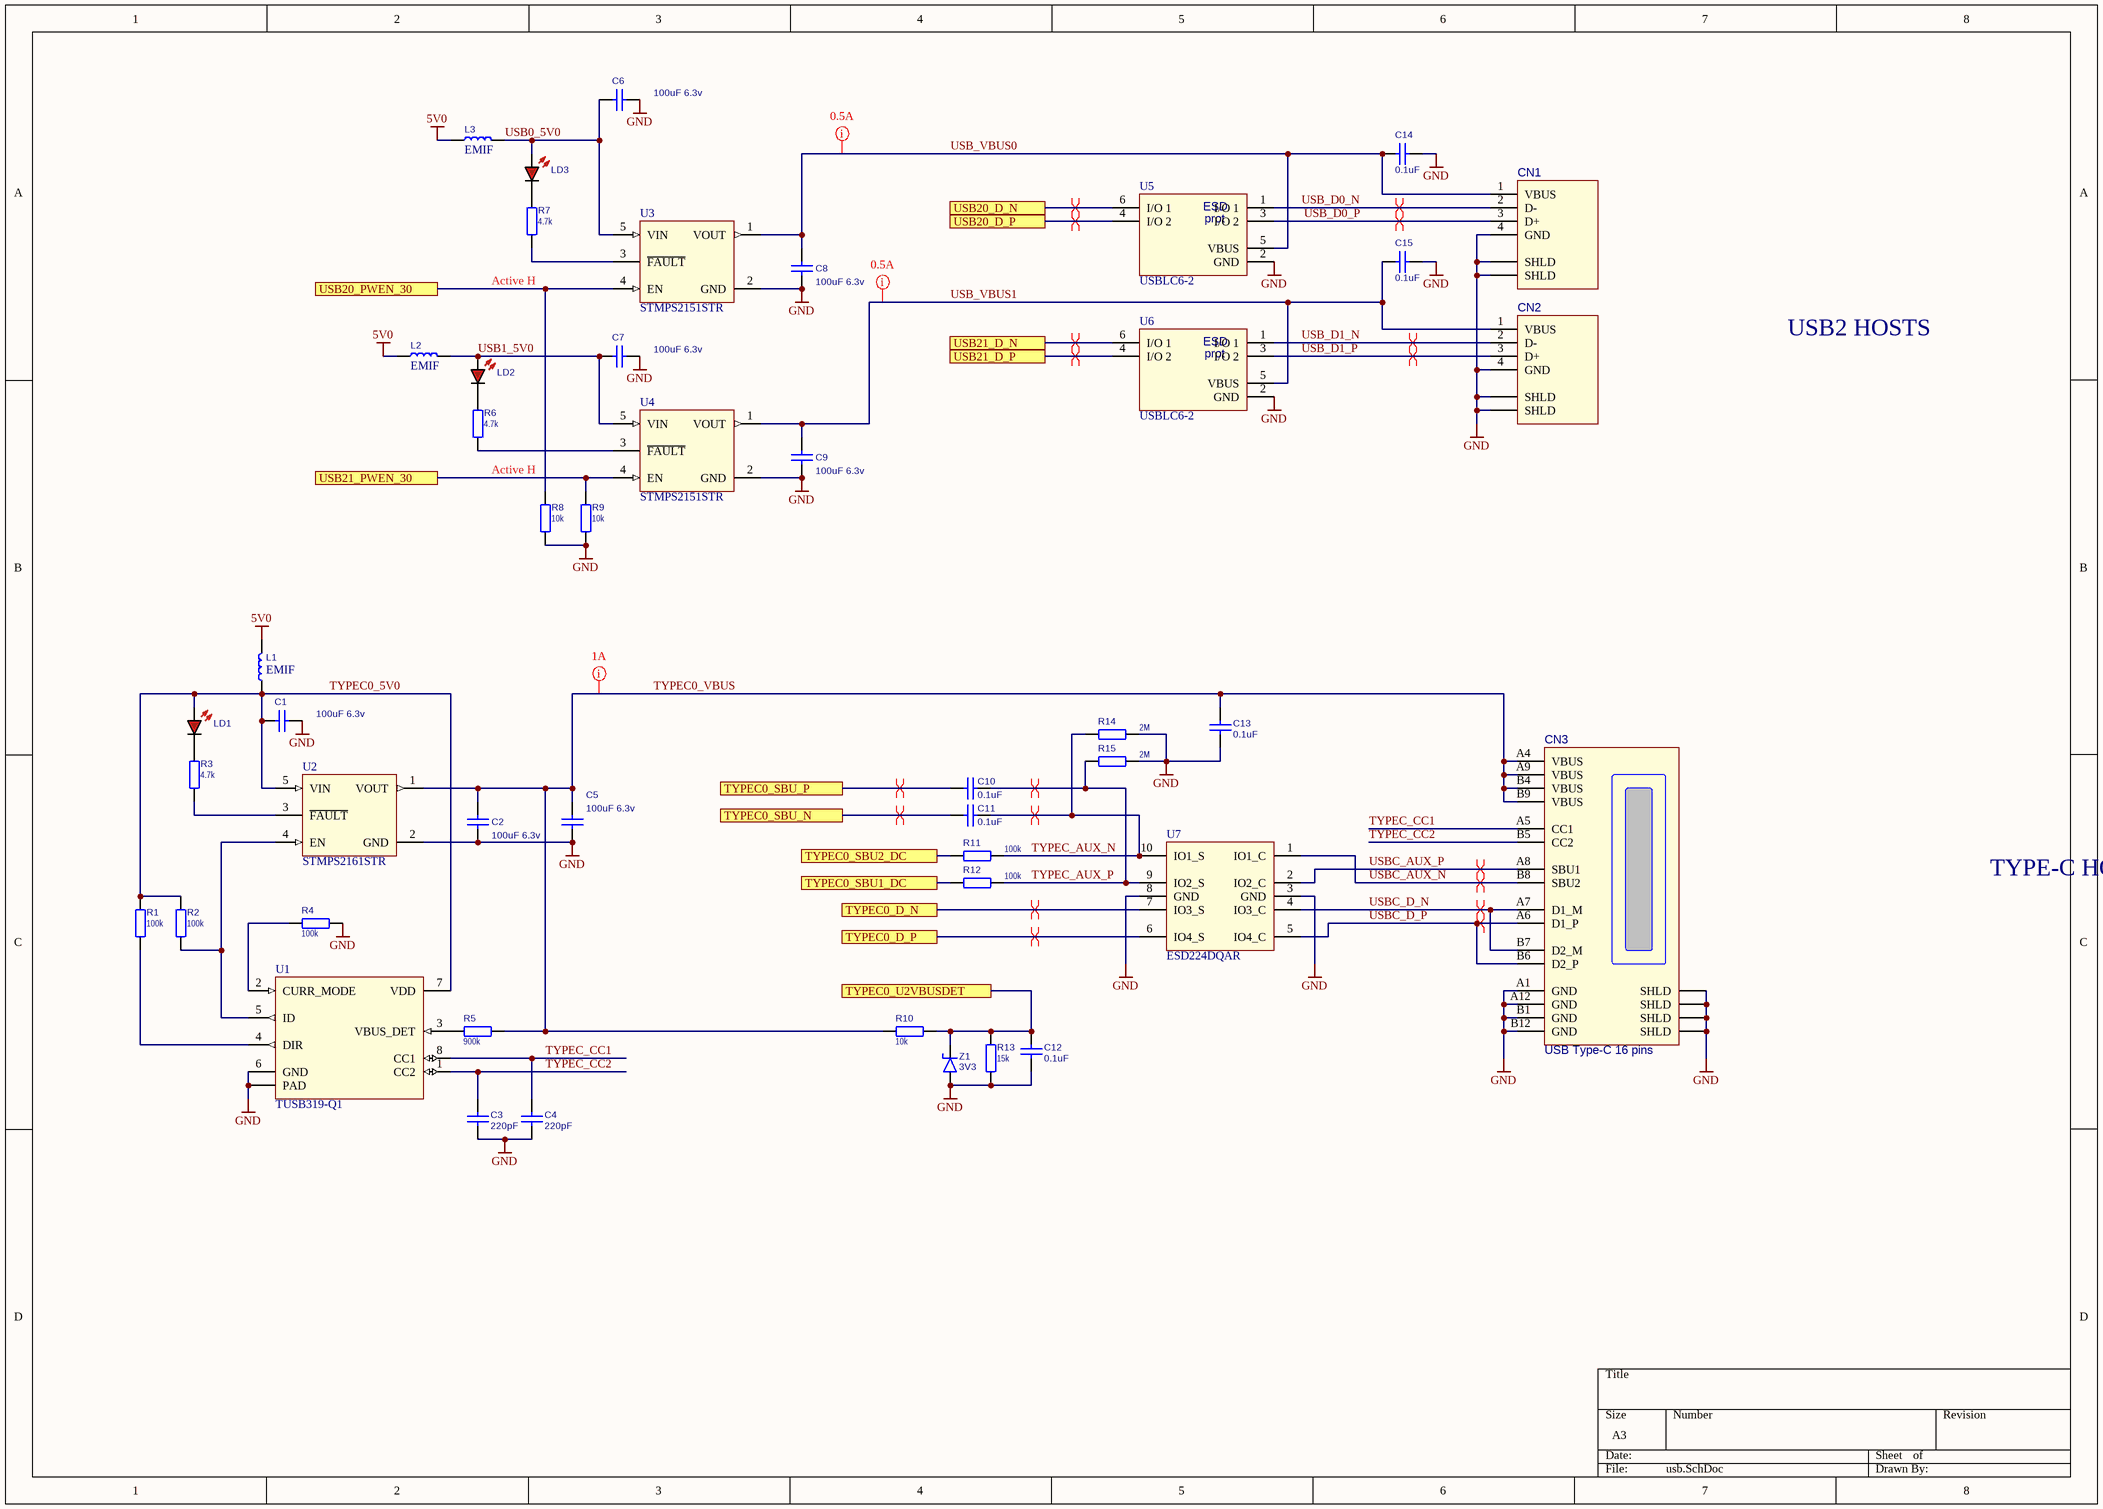
[diagram p5: usb.SchDoc]

### Parts
C1  value 100uF 6.3v  [C1206]  (hidden comment: CL31A107MQHNNNE)
C2  value 100uF 6.3v  [C1206]  (hidden comment: CL31A107MQHNNNE)
C3  value 220pF  [C0603]  (hidden comment: CL10C221JB8NNNC)
C4  value 220pF  [C0603]  (hidden comment: CL10C221JB8NNNC)
C5  value 100uF 6.3v  [C1206]  (hidden comment: CL31A107MQHNNNE)
C6  value 100uF 6.3v  [C1206]  (hidden comment: CL31A107MQHNNNE)
C7  value 100uF 6.3v  [C1206]  (hidden comment: CL31A107MQHNNNE)
C8  value 100uF 6.3v  [C1206]  (hidden comment: CL31A107MQHNNNE)
C9  value 100uF 6.3v  [C1206]  (hidden comment: CL31A107MQHNNNE)
C10  value 0.1uF  [C0603]  (hidden comment: C1608X7R1H104K080AA)
C11  value 0.1uF  [C0603]  (hidden comment: C1608X7R1H104K080AA)
C12  value 0.1uF  [C0603]  (hidden comment: C1608X7R1H104K080AA)
C13  value 0.1uF  [C0603]  (hidden comment: C1608X7R1H104K080AA)
C14  value 0.1uF  [C0603]  (hidden comment: C1608X7R1H104K080AA)
C15  value 0.1uF  [C0603]  (hidden comment: C1608X7R1H104K080AA)
CN1  USB Type-A Single  [USB-A-SINGLE]  (value not drawn)
CN2  USB Type-A Single  [USB-A-SINGLE]  (value not drawn)
CN3  USB Type-C 16 pins  [USB-C-16P]
L1  value EMIF  [IND0805]  (hidden comment: BLM21PG221SN1D)
L2  value EMIF  [IND0805]  (hidden comment: BLM21PG221SN1D)
L3  value EMIF  [IND0805]  (hidden comment: BLM21PG221SN1D)
LD1  LED_R  [R0805]  (value not drawn)
LD2  LED_R  [R0805]  (value not drawn)
LD3  LED_R  [R0805]  (value not drawn)
R1  100k  [R0603]
R2  100k  [R0603]
R3  4.7k  [R0603]
R4  100k  [R0603]
R5  900k  [R0603]
R6  4.7k  [R0603]
R7  4.7k  [R0603]
R8  10k  [R0603]
R9  10k  [R0603]
R10  10k  [R0603]
R11  100k  [R0603]
R12  100k  [R0603]
R13  15k  [R0603]
R14  2M  [R0603]
R15  2M  [R0603]
U1  TUSB319-Q1  [PWSON-8]
U2  STMPS2161STR  [SOT-23-5]
U3  STMPS2151STR  [SOT-23-5]
U4  STMPS2151STR  [SOT-23-5]
U5  USBLC6-2  [SOT-23-6]
U6  USBLC6-2  [SOT-23-6]
U7  ESD224DQAR  [USON-10]
Z1  value 3V3  [SOD-80C]  (hidden comment: BZV55-C3V3.115)

### Ports
TYPEC0_D_N, TYPEC0_D_P, TYPEC0_SBU1_DC, TYPEC0_SBU2_DC, TYPEC0_SBU_N, TYPEC0_SBU_P, TYPEC0_U2VBUSDET, USB20_D_N, USB20_D_P, USB20_PWEN_30, USB21_D_N, USB21_D_P, USB21_PWEN_30

### Nets
5V0: L1.1 L2.2 L3.2
GND: C1.1 C2.1 C3.2 C4.2 C5.1 C6.1 C7.1 C8.1 C9.1 C12.2 C13.2 C14.2 C15.2 CN1.4(GND) CN1.5(SHLD) CN1.6(SHLD) CN2.4(GND) CN2.5(SHLD) CN2.6(SHLD) CN3.1(SHLD) CN3.2(SHLD) CN3.3(SHLD) CN3.4(SHLD) CN3.A1(GND) CN3.A12(GND) CN3.B1(GND) CN3.B12(GND) R4.1 R8.2 R9.2 R13.1 R14.1 R15.1 U1.6(GND) U1.9(PAD) U2.2(GND) U3.2(GND) U4.2(GND) U5.2(GND) U6.2(GND) U7.3(GND) U7.8(GND) Z1.1(A)
TYPEC0_5V0: C1.2 L1.2 LD1.2 R1.2 R2.2 U1.7(VDD) U2.5(VIN)
TYPEC0_D_N: U7.7(IO3_S) ; port TYPEC0_D_N
TYPEC0_D_P: U7.6(IO4_S) ; port TYPEC0_D_P
TYPEC0_SBU1_DC: R12.2 ; port TYPEC0_SBU1_DC
TYPEC0_SBU2_DC: R11.2 ; port TYPEC0_SBU2_DC
TYPEC0_SBU_N: C11.2 ; port TYPEC0_SBU_N
TYPEC0_SBU_P: C10.2 ; port TYPEC0_SBU_P
TYPEC0_U2VBUSDET: C12.1 R10.2 R13.2 Z1.2(K) ; port TYPEC0_U2VBUSDET
TYPEC0_VBUS: C2.2 C5.2 C13.1 CN3.A4(VBUS) CN3.A9(VBUS) CN3.B4(VBUS) CN3.B9(VBUS) R5.2 R10.1 U2.1(VOUT)
TYPEC_AUX_N: C11.1 R11.1 R14.2 U7.10(IO1_S)
TYPEC_AUX_P: C10.1 R12.1 R15.2 U7.9(IO2_S)
TYPEC_CC1: C4.1 CN3.A5(CC1) U1.8(CC1)
TYPEC_CC2: C3.1 CN3.B5(CC2) U1.1(CC2)
USB0_5V0: C6.2 L3.1 LD3.2 U3.5(VIN)
USB1_5V0: C7.2 L2.1 LD2.2 U4.5(VIN)
USB20_D_N: U5.6(I/O_1) ; port USB20_D_N
USB20_D_P: U5.4(I/O_2) ; port USB20_D_P
USB20_PWEN_30: R8.1 U3.4(EN) ; port USB20_PWEN_30
USB21_D_N: U6.6(I/O_1) ; port USB21_D_N
USB21_D_P: U6.4(I/O_2) ; port USB21_D_P
USB21_PWEN_30: R9.1 U4.4(EN) ; port USB21_PWEN_30
USB_D0_N: CN1.2(D-) U5.1(I/O_1)
USB_D0_P: CN1.3(D+) U5.3(I/O_2)
USB_D1_N: CN2.2(D-) U6.1(I/O_1)
USB_D1_P: CN2.3(D+) U6.3(I/O_2)
USB_VBUS0: C8.2 C14.1 CN1.1(VBUS) U3.1(VOUT) U5.5(VBUS)
USB_VBUS1: C9.2 C15.1 CN2.1(VBUS) U4.1(VOUT) U6.5(VBUS)
USBC_AUX_N: CN3.B8(SBU2) U7.1(IO1_C)
USBC_AUX_P: CN3.A8(SBU1) U7.2(IO2_C)
USBC_D_N: CN3.A7(D1_M) CN3.B7(D2_M) U7.4(IO3_C)
USBC_D_P: CN3.A6(D1_P) CN3.B6(D2_P) U7.5(IO4_C)
NetLD1_1: LD1.1 R3.2
NetLD2_1: LD2.1 R6.1
NetLD3_1: LD3.1 R7.2
NetR1_1: R1.1 U1.4(DIR)
NetR2_1: R2.1 U1.5(ID) U2.4(EN)
NetR3_1: R3.1 U2.3(~{FAULT})
NetR4_2: R4.2 U1.2(CURR_MODE)
NetR5_1: R5.1 U1.3(VBUS_DET)
NetR6_2: R6.2 U4.3(~{FAULT})
NetR7_1: R7.1 U3.3(~{FAULT})

### Layout directives
differential pair: TYPEC0_D_N, TYPEC0_D_P, TYPEC0_SBU_N, TYPEC0_SBU_P, TYPEC_AUX_N, TYPEC_AUX_P, USB20_D_N, USB20_D_P, USB21_D_N, USB21_D_P, USB_D0_N, USB_D0_P, USB_D1_N, USB_D1_P, USBC_AUX_N, USBC_AUX_P, USBC_D_N, USBC_D_P
mark named 0.5A: USB_VBUS0, USB_VBUS1
mark named 1A: TYPEC0_VBUS

### Notes on the sheet
- (near R7) Active H
- USB2 HOSTS
- Active H
- TYPE-C HOST (USB 2.0)
- (in symbol USBLC6-2) ESD; prot

### Library data of the parts
C1-C15 = CAP_NPOL
CN1 CN2 = USB-A-SINGLE: Value: KLS1-181A
CN3 = USB-C-16: Value: USB Type-C
L1-L3 = IND_WO_IRON
LD1-LD3 = LED_RED: LED Red; Value: *
R1-R15 = RESISTOR: RES
  R1 R2 R4 R11 R12: Value: 100k
  R3 R6 R7: Value: 4.7k
  R5: Value: 900k
  R8-R10: Value: 10k
  R13: Value: 15k
  R14 R15: Value: 2M
U1 = TUSB319: TUSB319-Q1 USB Type-C DFP Port Controller; value: TUSB319-Q1
U2-U4 = STMPS21x1STR: value: STMPS21x1STR
U5 U6 = USBLC6-2: Ultralow capacitance ESD protection; value: USBLC6-2
U7 = ESD224: ESD224 Low Clamping 4-Channel ESD Protection Device for HDMI Interface; value: ESD224
Z1 = ZENNER_1: ZENNER

## Sheet debug.SchDoc
size A4
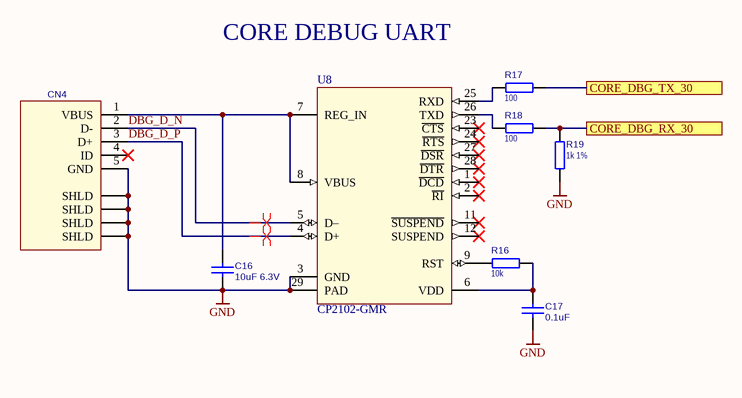
[diagram p6: debug.SchDoc]

### Parts
C16  value 10uF 6.3V  [C0603]  (hidden comment: CC0603MRX5R5BB106)
C17  value 0.1uF  [C0603]  (hidden comment: C1608X7R1H104K080AA)
CN4  USB Type-B mini  [USB-B_SMD-MICRO-01]  (value not drawn)
R16  10k  [R0603]
R17  100  [R0603]
R18  100  [R0603]
R19  1k 1%  [R0603]
U8  CP2102-GMR  [QFN-28-4x4]

### Ports
CORE_DBG_RX_30, CORE_DBG_TX_30

### Nets
GND: C16.2 C17.2 CN4.5(GND) CN4.6(SHLD) CN4.7(SHLD) CN4.8(SHLD) CN4.9(SHLD) R19.2 U8.3(GND) U8.29(PAD)
CORE_DBG_RX_30: R18.1 R19.1 ; port CORE_DBG_RX_30
CORE_DBG_TX_30: R17.1 ; port CORE_DBG_TX_30
DBG_D_N: CN4.2(D-) U8.5(D–)
DBG_D_P: CN4.3(D+) U8.4(D+)
NetC16_1: C16.1 CN4.1(VBUS) U8.7(REG_IN) U8.8(VBUS)
NetC17_1: C17.1 R16.1 U8.6(VDD)
NetR16_2: R16.2 U8.9(RST)
NetR17_2: R17.2 U8.25(RXD)
NetR18_2: R18.2 U8.26(TXD)

Not connected (* = marked no-connect by the designer): CN4 4(ID)* MH1 MH2; U8 1(~{DCD})* 2(~{RI})* 11(~{SUSPEND})* 12(SUSPEND)* 23(~{CTS})* 24(~{RTS})* 27(~{DSR})* 28(~{DTR})*

### Layout directives
differential pair: DBG_D_N, DBG_D_P

### Notes on the sheet
- CORE DEBUG UART

### Library data of the parts
C16 C17 = CAP_NPOL
CN4 = USB-B-M: Value: KLS1-229-5FD
R16-R19 = RESISTOR: RES
  R16: Value: 10k
  R17 R18: Value: 100
  R19: Value: 1k 1%
U8 = CP2102: SINGLE-CHIP USB-TO-UART BRIDGE; value: CP2102-GMR

## Sheet hdmi.SchDoc
size A4
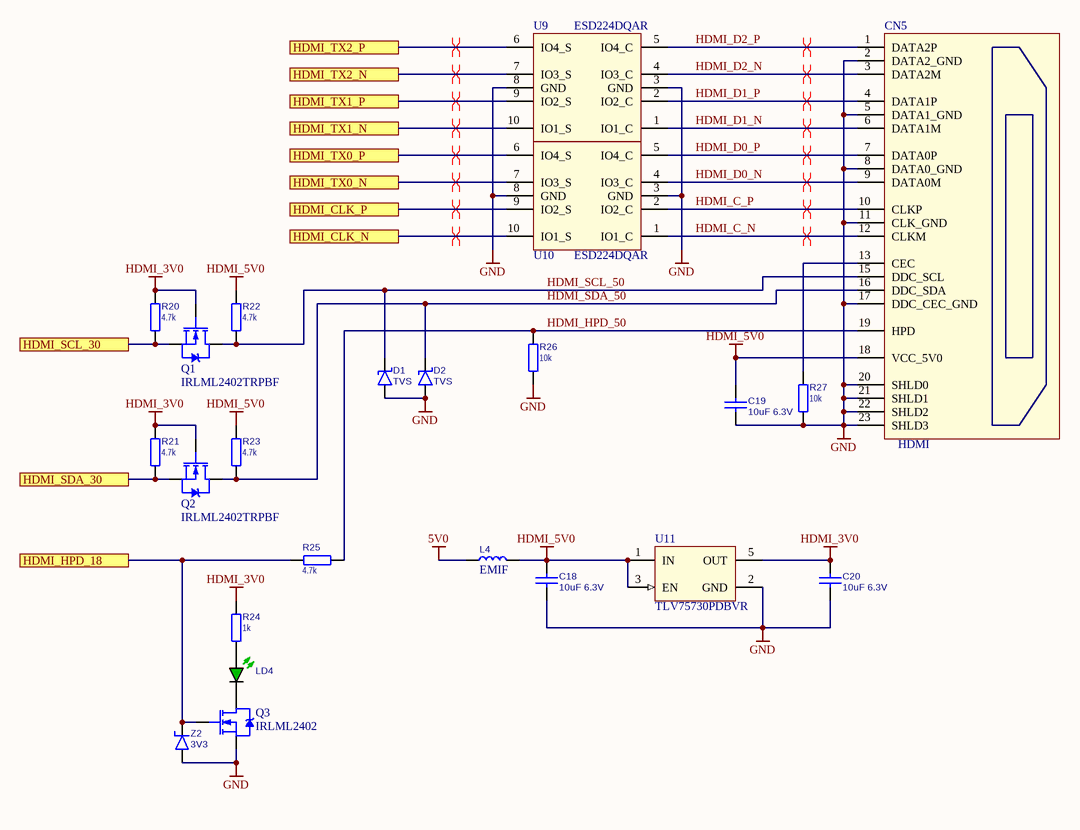
[diagram p7: hdmi.SchDoc]

### Parts
C18  value 10uF 6.3V  [C0603]  (hidden comment: CC0603MRX5R5BB106)
C19  value 10uF 6.3V  [C0603]  (hidden comment: CC0603MRX5R5BB106)
C20  value 10uF 6.3V  [C0603]  (hidden comment: CC0603MRX5R5BB106)
CN5  value HDMI  [1747981-1]  (hidden comment: KLS1-285-19-22-N1B)
D1  value TVS  [SOD-323]  (hidden comment: CDSOD323-T05LC)
D2  value TVS  [SOD-323]  (hidden comment: CDSOD323-T05LC)
L4  value EMIF  [IND0805]  (hidden comment: BLM21PG221SN1D)
LD4  LED_G  [LED0805]  (value not drawn)
Q1  IRLML2402TRPBF  [SOT-23-3]
Q2  IRLML2402TRPBF  [SOT-23-3]
Q3  IRLML2402  [SOT-23-3]
R20  4.7k  [R0603]
R21  4.7k  [R0603]
R22  4.7k  [R0603]
R23  4.7k  [R0603]
R24  1k  [R0603]
R25  4.7k  [R0603]
R26  10k  [R0603]
R27  10k  [R0603]
U9  ESD224DQAR  [USON-10]
U10  ESD224DQAR  [USON-10]
U11  TLV75730PDBVR  [SOT-23-5]
Z2  value 3V3  [SOD-80C]  (hidden comment: BZV55-C3V3.115)

### Ports
HDMI_CLK_N, HDMI_CLK_P, HDMI_HPD_18, HDMI_SCL_30, HDMI_SDA_30, HDMI_TX0_N, HDMI_TX0_P, HDMI_TX1_N, HDMI_TX1_P, HDMI_TX2_N, HDMI_TX2_P

### Nets
5V0: L4.2
GND: C18.2 C19.2 C20.2 CN5.2(DATA2_GND) CN5.5(DATA1_GND) CN5.8(DATA0_GND) CN5.11(CLK_GND) CN5.17(DDC_CEC_GND) CN5.20(SHLD0) CN5.21(SHLD1) CN5.22(SHLD2) CN5.23(SHLD3) D1.1(A) D2.1(A) Q3.2(S) R26.1 R27.1 U9.3(GND) U9.8(GND) U10.3(GND) U10.8(GND) U11.2(GND) Z2.1(A)
HDMI_3V0: C20.1 Q1.1(G) Q2.1(G) R20.2 R21.2 R24.2 U11.5(OUT)
HDMI_5V0: C18.1 C19.1 CN5.18(VCC_5V0) L4.1 R22.2 R23.2 U11.1(IN) U11.3(EN)
HDMI_C_N: CN5.12(CLKM) U10.1(IO1_C)
HDMI_C_P: CN5.10(CLKP) U10.2(IO2_C)
HDMI_CLK_N: U10.10(IO1_S) ; port HDMI_CLK_N
HDMI_CLK_P: U10.9(IO2_S) ; port HDMI_CLK_P
HDMI_D0_N: CN5.9(DATA0M) U10.4(IO3_C)
HDMI_D0_P: CN5.7(DATA0P) U10.5(IO4_C)
HDMI_D1_N: CN5.6(DATA1M) U9.1(IO1_C)
HDMI_D1_P: CN5.4(DATA1P) U9.2(IO2_C)
HDMI_D2_N: CN5.3(DATA2M) U9.4(IO3_C)
HDMI_D2_P: CN5.1(DATA2P) U9.5(IO4_C)
HDMI_HPD_18: Q3.1(G) R25.1 Z2.2(K) ; port HDMI_HPD_18
HDMI_HPD_50: CN5.19(HPD) R25.2 R26.2
HDMI_SCL_30: Q1.2(S) R20.1 ; port HDMI_SCL_30
HDMI_SCL_50: CN5.15(DDC_SCL) D1.2(K) Q1.3(D) R22.1
HDMI_SDA_30: Q2.2(S) R21.1 ; port HDMI_SDA_30
HDMI_SDA_50: CN5.16(DDC_SDA) D2.2(K) Q2.3(D) R23.1
HDMI_TX0_N: U10.7(IO3_S) ; port HDMI_TX0_N
HDMI_TX0_P: U10.6(IO4_S) ; port HDMI_TX0_P
HDMI_TX1_N: U9.10(IO1_S) ; port HDMI_TX1_N
HDMI_TX1_P: U9.9(IO2_S) ; port HDMI_TX1_P
HDMI_TX2_N: U9.7(IO3_S) ; port HDMI_TX2_N
HDMI_TX2_P: U9.6(IO4_S) ; port HDMI_TX2_P
NetCN5_13: CN5.13(CEC) R27.2
NetLD4_1: LD4.1 Q3.3(D)
NetLD4_2: LD4.2 R24.1

### Layout directives
differential pair: HDMI_C_N, HDMI_C_P, HDMI_CLK_N, HDMI_CLK_P, HDMI_D0_N, HDMI_D0_P, HDMI_D1_N, HDMI_D1_P, HDMI_D2_N, HDMI_D2_P, HDMI_TX0_N, HDMI_TX0_P, HDMI_TX1_N, HDMI_TX1_P, HDMI_TX2_N, HDMI_TX2_P

### Library data of the parts
C18-C20 = CAP_NPOL
CN5 = HDMI
D1 D2 = SHOTTKY
L4 = IND_WO_IRON
LD4 = LED_GREEN: LED Green; Value: *
Q1-Q3 = N-Channel: HEXFET Power MOSFET
  Q1: Value: IRLML2402
R20-R27 = RESISTOR: RES
  R20-R23 R25: Value: 4.7k
  R24: Value: 1k
  R26 R27: Value: 10k
U9 U10 = ESD224: as U7 on sheet usb; value: ESD224
U11 = TLV733P: as U23 on sheet dsi_csi; value: TLV733P
Z2 = ZENNER_1: ZENNER

## Sheet power.SchDoc
size A4
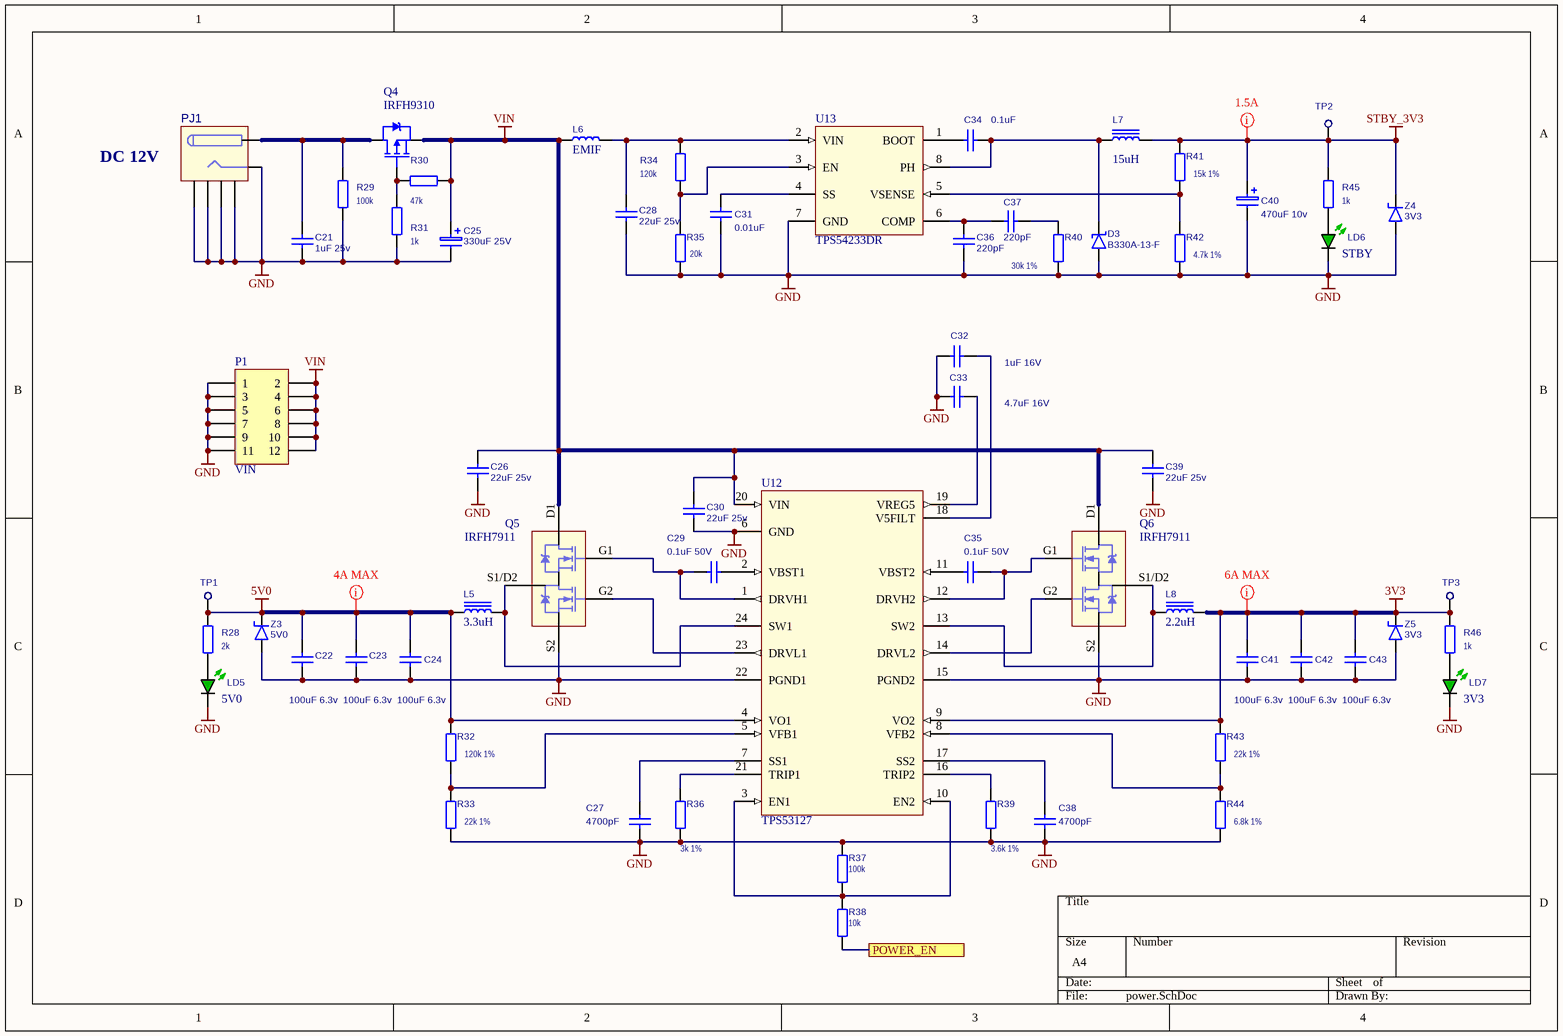
[diagram p8: power.SchDoc]

### Parts
C21  value 1uF 25v  [C0805]  (hidden comment: CL21B105KAFNNNE)
C22  value 100uF 6.3v  [C1206]  (hidden comment: CL31A107MQHNNNE)
C23  value 100uF 6.3v  [C1206]  (hidden comment: CL31A107MQHNNNE)
C24  value 100uF 6.3v  [C1206]  (hidden comment: CL31A107MQHNNNE)
C25  value 330uF 25V  [R08H04]  (hidden comment: ECAP 330/25V 0811 105'C)
C26  value 22uF 25v  [C0805]  (hidden comment: CL21A226MAQNNNE)
C27  value 4700pF  [C0603]  (hidden comment: CL10B472KB8NNNC)
C28  value 22uF 25v  [C0805]  (hidden comment: CL21A226MAQNNNE)
C29  value 0.1uF 50V  [C0603]  (hidden comment: C1608X7R1H104K080AA)
C30  value 22uF 25v  [C0805]  (hidden comment: CL21A226MAQNNNE)
C31  value 0.01uF  [C0603]  (hidden comment: CL10B103KB8NNNC)
C32  value 1uF 16V  [C0603]  (hidden comment: GRM188R61H105KAALD)
C33  value 4.7uF 16V  [C0805]  (hidden comment: CL21A475KOFNNNE)
C34  value 0.1uF  [C0603]  (hidden comment: C1608X7R1H104K080AA)
C35  value 0.1uF 50V  [C0603]  (hidden comment: C1608X7R1H104K080AA)
C36  value 220pF  [C0603]  (hidden comment: CL10C221JB8NNNC)
C37  value 220pF  [C0603]  (hidden comment: CL10C221JB8NNNC)
C38  value 4700pF  [C0603]  (hidden comment: CL10B472KB8NNNC)
C39  value 22uF 25v  [C0805]  (hidden comment: CL21A226MAQNNNE)
C40  value 470uF 10v  [R06H11]  (hidden comment: ECAP 470/10V 0611 105'C)
C41  value 100uF 6.3v  [C1206]  (hidden comment: CL31A107MQHNNNE)
C42  value 100uF 6.3v  [C1206]  (hidden comment: CL31A107MQHNNNE)
C43  value 100uF 6.3v  [C1206]  (hidden comment: CL31A107MQHNNNE)
D3  B330A-13-F  [SMA]
L5  value 3.3uH  [IHLP-2525CZ]  (hidden comment: IHLP2525CZER3R3M01)
L6  value EMIF  [IND0805]  (hidden comment: BLM21PG221SN1D)
L7  value 15uH  [CDRH104R]  (hidden comment: CDRH104RNP-150NC)
L8  value 2.2uH  [IHLP-2525CZ]  (hidden comment: IHLP2525CZER2R2M01)
LD5  value 5V0  [LED0805]  (hidden comment: LED_G)
LD6  value STBY  [LED0805]  (hidden comment: LED_G)
LD7  value 3V3  [LED0805]  (hidden comment: LED_G)
P1  VIN  [PLD-6]
PJ1  PJ-082BH  [PJ-082BH]  (value not drawn)
Q4  IRFH9310  [PQFN_5X6]
Q5  value IRFH7911  [PQFN5X6_DUAL]  (hidden comment: IRFH7911TR2PBF)
Q6  value IRFH7911  [PQFN5X6_DUAL]  (hidden comment: IRFH7911TR2PBF)
R28  2k  [R0603]
R29  100k  [R0603]
R30  47k  [R0603]
R31  1k  [R0603]
R32  120k 1%  [R0603]
R33  22k 1%  [R0603]
R34  120k  [R0603]
R35  20k  [R0603]
R36  3k 1%  [R0603]
R37  100k  [R0603]
R38  10k  [R0603]
R39  3.6k 1%  [R0603]
R40  30k 1%  [R0603]
R41  15k 1%  [R0603]
R42  4.7k 1%  [R0603]
R43  22k 1%  [R0603]
R44  6.8k 1%  [R0603]
R45  1k  [R0603]
R46  1k  [R0603]
TP1  TEST-POINT  [PAD]  (value not drawn)
TP2  TEST-POINT  [PAD]  (value not drawn)
TP3  TEST-POINT  [PAD]  (value not drawn)
U12  TPS53127  [TSSOP-24]
U13  TPS54233DR  [D008_N]
Z3  value 5V0  [SMB]  (hidden comment: SMBJ5.0A-TR)
Z4  value 3V3  [SMB]  (hidden comment: SMBJ3V3-E3/52)
Z5  value 3V3  [SMB]  (hidden comment: SMBJ3V3-E3/52)

### Ports
POWER_EN

### Nets
3V3: C41.2 C42.2 C43.2 L8.2 R43.1 R46.2 TP3.1 U12.9(VO2) Z5.2(K)
5V0: C22.1 C23.1 C24.2 L5.1 R28.2 R32.1 TP1.1 U12.4(VO1) Z3.2(K)
GND: C21.2 C22.2 C23.2 C24.1 C25.2(-) C26.1 C27.1 C28.1 C30.1 C31.1 C32.1 C33.2 C36.1 C38.1 C39.1 C40.2(-) C41.1 C42.1 C43.1 D3.1(A) LD5.1 LD6.1 LD7.1 P1.1 P1.3 P1.5 P1.7 P1.9 P1.11 PJ1.2 PJ1.MH1 PJ1.MH2 PJ1.MH3 PJ1.MH4 Q5.S2 Q6.S2 R29.2 R31.2 R33.2 R35.2 R36.2 R37.1 R39.2 R40.2 R42.2 R44.2 U12.6(GND) U12.15(PGND2) U12.22(PGND1) U13.7(GND) Z3.1(A) Z4.1(A) Z5.1(A)
STBY_3V3: C40.1(+) L7.2 R41.1 R45.2 TP2.1 Z4.2(K)
VIN: C25.1(+) C26.2 C30.2 C39.2 L6.2 P1.2 P1.4 P1.6 P1.8 P1.10 P1.12 Q4.2(S) Q5.D1 Q6.D1 R30.2 U12.20(VIN)
POWER_EN: R38.1 ; port POWER_EN
NetC21_1: C21.1 PJ1.1 Q4.3(D) R29.1
NetC27_2: C27.2 U12.7(SS1)
NetC28_2: C28.2 L6.1 R34.1 U13.2(VIN)
NetC29_1: C29.1 U12.2(VBST1)
NetC29_2: C29.2 Q5.G1 U12.1(DRVH1)
NetC31_2: C31.2 U13.4(SS)
NetC32_2: C32.2 U12.18(V5FILT)
NetC33_1: C33.1 U12.19(VREG5)
NetC34_1: C34.1 D3.2(K) L7.1 U13.8(PH)
NetC34_2: C34.2 U13.1(BOOT)
NetC35_1: C35.1 Q6.G1 U12.12(DRVH2)
NetC35_2: C35.2 U12.11(VBST2)
NetC36_2: C36.2 C37.1 U13.6(COMP)
NetC37_2: C37.2 R40.1
NetC38_2: C38.2 U12.17(SS2)
NetL5_2: L5.2 Q5.S1/D2 U12.24(SW1)
NetL8_1: L8.1 Q6.S1/D2 U12.13(SW2)
NetLD5_2: LD5.2 R28.1
NetLD6_2: LD6.2 R45.1
NetLD7_2: LD7.2 R46.1
NetQ4_1: Q4.1(G) R30.1 R31.1
NetQ5_G2: Q5.G2 U12.23(DRVL1)
NetQ6_G2: Q6.G2 U12.14(DRVL2)
NetR32_2: R32.2 R33.1 U12.5(VFB1)
NetR34_2: R34.2 R35.1 U13.3(EN)
NetR36_1: R36.1 U12.21(TRIP1)
NetR37_2: R37.2 R38.2 U12.3(EN1) U12.10(EN2)
NetR39_1: R39.1 U12.16(TRIP2)
NetR41_2: R41.2 R42.1 U13.5(VSENSE)
NetR43_2: R43.2 R44.1 U12.8(VFB2)

### Layout directives
mark named 1.5A: STBY_3V3
mark named 4A MAX: 5V0
mark named 6A MAX: 3V3

### Notes on the sheet
- (near PJ1) DC 12V

### Library data of the parts
C21-C24 C26-C39 C41-C43 = CAP_NPOL
C25 C40 = CAP_POL
D3 = SHOTTKY: Value: B330A-13-F
L5 L7 L8 = IND_W_IRON
L6 = IND_WO_IRON
LD5-LD7 = LED_GREEN: LED Green
P1 = HDR 6X2: Header, 6-Pin, Dual row; LatestRevisionDate: 17-Jul-2002; LatestRevisionNote: Re-released for DXP Platform.; Publisher: Altium Limited
PJ1 = PowerJack 2P: Value: PowerJack 2P
Q4 = P-Channel: HEXFET Power MOSFET; Value: IRFH9310
Q5 Q6 = IRFH7911: HEXFET Power MOSFET
R28-R46 = RESISTOR: RES
  R28: Value: 2k
  R29 R37: Value: 100k
  R30: Value: 47k
  R31 R45 R46: Value: 1k
  R32: Value: 120k 1%
  R33 R43: Value: 22k 1%
  R34: Value: 120k
  R35: Value: 20k
  R36: Value: 3k 1%
  R38: Value: 10k
  R39: Value: 3.6k 1%
  R40: Value: 30k 1%
  R41: Value: 15k 1%
  R42: Value: 4.7k 1%
  R44: Value: 6.8k 1%
TP1-TP3 = TEST-POINT: PCB terminal block; Value: *
U12 = TPS53127: Dual Synchronous Step-Down Controller  For Low Voltage Power Rails; value: TPS53127
U13 = TPS54232: TPS54232 2-A, 28-V, 300kHz, Step-Down DC-DC Converter With Eco-Mode™; value: TPS54233
Z3-Z5 = ZENNER_1: ZENNER

## Sheet x3399.SchDoc
size A3
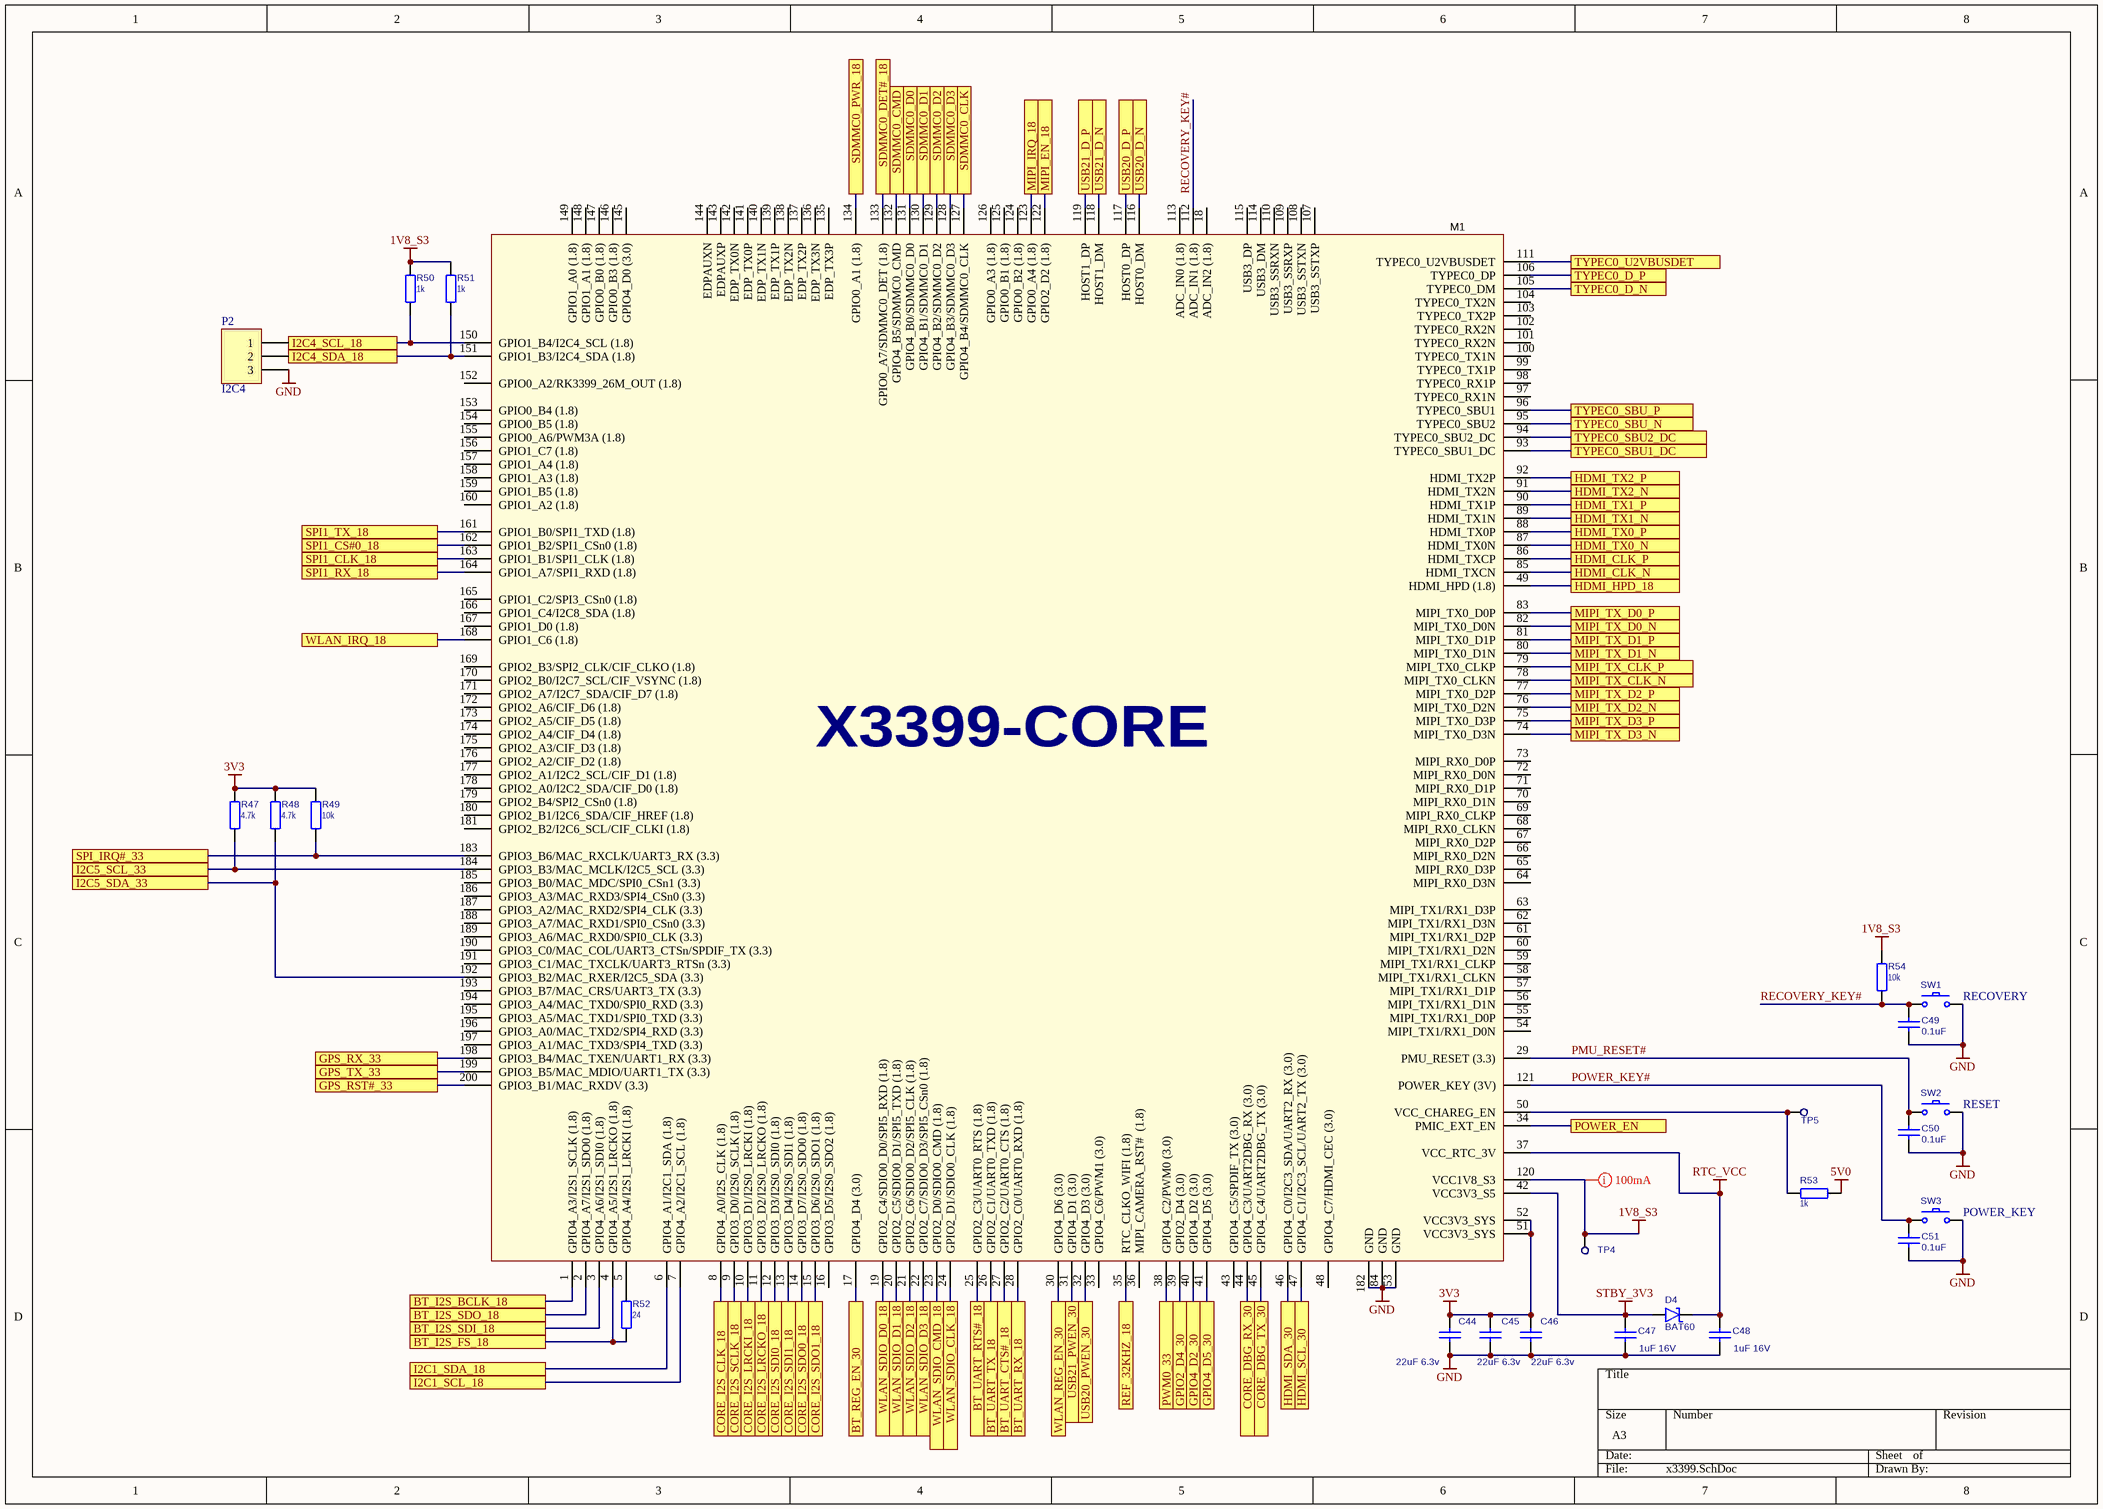
[diagram p9: x3399.SchDoc]

### Parts
C44  value 22uF 6.3v  [C0805]  (hidden comment: CL21A226MQQNNNE)
C45  value 22uF 6.3v  [C0805]  (hidden comment: CL21A226MQQNNNE)
C46  value 22uF 6.3v  [C0805]  (hidden comment: CL21A226MQQNNNE)
C47  value 1uF 16V  [C0603]  (hidden comment: GRM188R61H105KAALD)
C48  value 1uF 16V  [C0603]  (hidden comment: GRM188R61H105KAALD)
C49  value 0.1uF  [C0603]  (hidden comment: C1608X7R1H104K080AA)
C50  value 0.1uF  [C0603]  (hidden comment: C1608X7R1H104K080AA)
C51  value 0.1uF  [C0603]  (hidden comment: C1608X7R1H104K080AA)
D4  value BAT60  [SOD-323]  (hidden comment: BAT60AE6327HTSA1)
M1  X3399-CORE  [X3399-CORE]  (value not drawn)
P2  I2C4  [PLS-3]
R47  4.7k  [R0603]
R48  4.7k  [R0603]
R49  10k  [R0603]
R50  1k  [R0603]
R51  1k  [R0603]
R52  24  [R0603]
R53  1k  [R0603]
R54  10k  [R0603]
SW1  RECOVERY  [TACTM-34N-F]
SW2  RESET  [TACTM-34N-F]
SW3  POWER_KEY  [TACTM-34N-F]
TP4  TEST-POINT  [PAD]  (value not drawn)
TP5  TEST-POINT  [PAD]  (value not drawn)

### Ports
BT_I2S_BCLK_18, BT_I2S_FS_18, BT_I2S_SDI_18, BT_I2S_SDO_18, BT_REG_EN_30, BT_UART_CTS#_18, BT_UART_RTS#_18, BT_UART_RX_18, BT_UART_TX_18, CORE_DBG_RX_30, CORE_DBG_TX_30, CORE_I2S_CLK_18, CORE_I2S_LRCKI_18, CORE_I2S_LRCKO_18, CORE_I2S_SCLK_18, CORE_I2S_SDI0_18, CORE_I2S_SDI1_18, CORE_I2S_SDO0_18, CORE_I2S_SDO1_18, GPIO2_D4_30, GPIO4_D2_30, GPIO4_D5_30, GPS_RST#_33, GPS_RX_33, GPS_TX_33, HDMI_CLK_N, HDMI_CLK_P, HDMI_HPD_18, HDMI_SCL_30, HDMI_SDA_30, HDMI_TX0_N, HDMI_TX0_P, HDMI_TX1_N, HDMI_TX1_P, HDMI_TX2_N, HDMI_TX2_P, I2C1_SCL_18, I2C1_SDA_18, I2C4_SCL_18, I2C4_SDA_18, I2C5_SCL_33, I2C5_SDA_33, MIPI_EN_18, MIPI_IRQ_18, MIPI_TX_CLK_N, MIPI_TX_CLK_P, MIPI_TX_D0_N, MIPI_TX_D0_P, MIPI_TX_D1_N, MIPI_TX_D1_P, MIPI_TX_D2_N, MIPI_TX_D2_P, MIPI_TX_D3_N, MIPI_TX_D3_P, POWER_EN, PWM0_33, REF_32KHZ_18, SDMMC0_CLK, SDMMC0_CMD, SDMMC0_D0, SDMMC0_D1, SDMMC0_D2, SDMMC0_D3, SDMMC0_DET#_18, SDMMC0_PWR_18, SPI1_CLK_18, SPI1_CS#0_18, SPI1_RX_18, SPI1_TX_18, SPI_IRQ#_33, TYPEC0_D_N, TYPEC0_D_P, TYPEC0_SBU1_DC, TYPEC0_SBU2_DC, TYPEC0_SBU_N, TYPEC0_SBU_P, TYPEC0_U2VBUSDET, USB20_D_N, USB20_D_P, USB20_PWEN_30, USB21_D_N, USB21_D_P, USB21_PWEN_30, WLAN_IRQ_18, WLAN_REG_EN_30, WLAN_SDIO_CLK_18, WLAN_SDIO_CMD_18, WLAN_SDIO_D0_18, WLAN_SDIO_D1_18, WLAN_SDIO_D2_18, WLAN_SDIO_D3_18

### Nets
1V8_S3: M1.120(VCC1V8_S3) R50.2 R51.1 R54.2 TP4.1
3V3: C44.1 C45.1 C46.1 M1.51(VCC3V3_SYS) M1.52(VCC3V3_SYS) R47.2 R48.1 R49.1
5V0: R53.1
GND: C44.2 C45.2 C46.2 C47.1 C48.1 C49.2 C50.2 C51.2 M1.53(GND) M1.84(GND) M1.182(GND) P2.3 SW1.2 SW2.2 SW3.2
RTC_VCC: C48.2 D4.2(K) M1.37(VCC_RTC_3V)
STBY_3V3: C47.2 D4.1(A) M1.42(VCC3V3_S5)
BT_I2S_BCLK_18: M1.1(GPIO4_A3/I2S1_SCLK_(1.8)) ; port BT_I2S_BCLK_18
BT_I2S_FS_18: M1.4(GPIO4_A5/I2S1_LRCKO_(1.8)) R52.2 ; port BT_I2S_FS_18
BT_I2S_SDI_18: M1.3(GPIO4_A6/I2S1_SDI0_(1.8)) ; port BT_I2S_SDI_18
BT_I2S_SDO_18: M1.2(GPIO4_A7/I2S1_SDO0_(1.8)) ; port BT_I2S_SDO_18
BT_REG_EN_30: M1.17(GPIO4_D4_(3.0)) ; port BT_REG_EN_30
BT_UART_CTS#_18: M1.27(GPIO2_C2/UART0_CTS_(1.8)) ; port BT_UART_CTS#_18
BT_UART_RTS#_18: M1.25(GPIO2_C3/UART0_RTS_(1.8)) ; port BT_UART_RTS#_18
BT_UART_RX_18: M1.28(GPIO2_C0/UART0_RXD_(1.8)) ; port BT_UART_RX_18
BT_UART_TX_18: M1.26(GPIO2_C1/UART0_TXD_(1.8)) ; port BT_UART_TX_18
CORE_DBG_RX_30: M1.44(GPIO4_C3/UART2DBG_RX_(3.0)) ; port CORE_DBG_RX_30
CORE_DBG_TX_30: M1.45(GPIO4_C4/UART2DBG_TX_(3.0)) ; port CORE_DBG_TX_30
CORE_I2S_CLK_18: M1.8(GPIO4_A0/I2S_CLK_(1.8)) ; port CORE_I2S_CLK_18
CORE_I2S_LRCKI_18: M1.10(GPIO3_D1/I2S0_LRCKI_(1.8)) ; port CORE_I2S_LRCKI_18
CORE_I2S_LRCKO_18: M1.11(GPIO3_D2/I2S0_LRCKO_(1.8)) ; port CORE_I2S_LRCKO_18
CORE_I2S_SCLK_18: M1.9(GPIO3_D0/I2S0_SCLK_(1.8)) ; port CORE_I2S_SCLK_18
CORE_I2S_SDI0_18: M1.12(GPIO3_D3/I2S0_SDI0_(1.8)) ; port CORE_I2S_SDI0_18
CORE_I2S_SDI1_18: M1.13(GPIO3_D4/I2S0_SDI1_(1.8)) ; port CORE_I2S_SDI1_18
CORE_I2S_SDO0_18: M1.14(GPIO3_D7/I2S0_SDO0_(1.8)) ; port CORE_I2S_SDO0_18
CORE_I2S_SDO1_18: M1.15(GPIO3_D6/I2S0_SDO1_(1.8)) ; port CORE_I2S_SDO1_18
GPIO2_D4_30: M1.39(GPIO2_D4_(3.0)) ; port GPIO2_D4_30
GPIO4_D2_30: M1.40(GPIO4_D2_(3.0)) ; port GPIO4_D2_30
GPIO4_D5_30: M1.41(GPIO4_D5_(3.0)) ; port GPIO4_D5_30
GPS_RST#_33: M1.200(GPIO3_B1/MAC_RXDV_(3.3)) ; port GPS_RST#_33
GPS_RX_33: M1.198(GPIO3_B4/MAC_TXEN/UART1_RX_(3.3)) ; port GPS_RX_33
GPS_TX_33: M1.199(GPIO3_B5/MAC_MDIO/UART1_TX_(3.3)) ; port GPS_TX_33
HDMI_CLK_N: M1.85(HDMI_TXCN) ; port HDMI_CLK_N
HDMI_CLK_P: M1.86(HDMI_TXCP) ; port HDMI_CLK_P
HDMI_HPD_18: M1.49(HDMI_HPD_(1.8)) ; port HDMI_HPD_18
HDMI_SCL_30: M1.47(GPIO4_C1/I2C3_SCL/UART2_TX_(3.0)) ; port HDMI_SCL_30
HDMI_SDA_30: M1.46(GPIO4_C0/I2C3_SDA/UART2_RX_(3.0)) ; port HDMI_SDA_30
HDMI_TX0_N: M1.87(HDMI_TX0N) ; port HDMI_TX0_N
HDMI_TX0_P: M1.88(HDMI_TX0P) ; port HDMI_TX0_P
HDMI_TX1_N: M1.89(HDMI_TX1N) ; port HDMI_TX1_N
HDMI_TX1_P: M1.90(HDMI_TX1P) ; port HDMI_TX1_P
HDMI_TX2_N: M1.91(HDMI_TX2N) ; port HDMI_TX2_N
HDMI_TX2_P: M1.92(HDMI_TX2P) ; port HDMI_TX2_P
I2C1_SCL_18: M1.7(GPIO4_A2/I2C1_SCL_(1.8)) ; port I2C1_SCL_18
I2C1_SDA_18: M1.6(GPIO4_A1/I2C1_SDA_(1.8)) ; port I2C1_SDA_18
I2C4_SCL_18: M1.150(GPIO1_B4/I2C4_SCL_(1.8)) P2.1 R50.1 ; port I2C4_SCL_18
I2C4_SDA_18: M1.151(GPIO1_B3/I2C4_SDA_(1.8)) P2.2 R51.2 ; port I2C4_SDA_18
I2C5_SCL_33: M1.184(GPIO3_B3/MAC_MCLK/I2C5_SCL_(3.3)) R47.1 ; port I2C5_SCL_33
I2C5_SDA_33: M1.192(GPIO3_B2/MAC_RXER/I2C5_SDA_(3.3)) R48.2 ; port I2C5_SDA_33
MIPI_EN_18: M1.122(GPIO2_D2_(1.8)) ; port MIPI_EN_18
MIPI_IRQ_18: M1.123(GPIO0_A4_(1.8)) ; port MIPI_IRQ_18
MIPI_TX_CLK_N: M1.78(MIPI_TX0_CLKN) ; port MIPI_TX_CLK_N
MIPI_TX_CLK_P: M1.79(MIPI_TX0_CLKP) ; port MIPI_TX_CLK_P
MIPI_TX_D0_N: M1.82(MIPI_TX0_D0N) ; port MIPI_TX_D0_N
MIPI_TX_D0_P: M1.83(MIPI_TX0_D0P) ; port MIPI_TX_D0_P
MIPI_TX_D1_N: M1.80(MIPI_TX0_D1N) ; port MIPI_TX_D1_N
MIPI_TX_D1_P: M1.81(MIPI_TX0_D1P) ; port MIPI_TX_D1_P
MIPI_TX_D2_N: M1.76(MIPI_TX0_D2N) ; port MIPI_TX_D2_N
MIPI_TX_D2_P: M1.77(MIPI_TX0_D2P) ; port MIPI_TX_D2_P
MIPI_TX_D3_N: M1.74(MIPI_TX0_D3N) ; port MIPI_TX_D3_N
MIPI_TX_D3_P: M1.75(MIPI_TX0_D3P) ; port MIPI_TX_D3_P
PMU_RESET#: C50.1 M1.29(PMU_RESET_(3.3)) SW2.1
POWER_EN: M1.34(PMIC_EXT_EN) ; port POWER_EN
POWER_KEY#: C51.1 M1.121(POWER_KEY_(3V)) SW3.1
PWM0_33: M1.38(GPIO4_C2/PWM0_(3.0)) ; port PWM0_33
RECOVERY_KEY#: C49.1 M1.112(ADC_IN1_(1.8)) R54.1 SW1.1
REF_32KHZ_18: M1.35(RTC_CLKO_WIFI_(1.8)) ; port REF_32KHZ_18
SDMMC0_CLK: M1.127(GPIO4_B4/SDMMC0_CLK) ; port SDMMC0_CLK
SDMMC0_CMD: M1.132(GPIO4_B5/SDMMC0_CMD) ; port SDMMC0_CMD
SDMMC0_D0: M1.131(GPIO4_B0/SDMMC0_D0) ; port SDMMC0_D0
SDMMC0_D1: M1.130(GPIO4_B1/SDMMC0_D1) ; port SDMMC0_D1
SDMMC0_D2: M1.129(GPIO4_B2/SDMMC0_D2) ; port SDMMC0_D2
SDMMC0_D3: M1.128(GPIO4_B3/SDMMC0_D3) ; port SDMMC0_D3
SDMMC0_DET#_18: M1.133(GPIO0_A7/SDMMC0_DET_(1.8)) ; port SDMMC0_DET#_18
SDMMC0_PWR_18: M1.134(GPIO0_A1_(1.8)) ; port SDMMC0_PWR_18
SPI1_CLK_18: M1.163(GPIO1_B1/SPI1_CLK_(1.8)) ; port SPI1_CLK_18
SPI1_CS#0_18: M1.162(GPIO1_B2/SPI1_CSn0_(1.8)) ; port SPI1_CS#0_18
SPI1_RX_18: M1.164(GPIO1_A7/SPI1_RXD_(1.8)) ; port SPI1_RX_18
SPI1_TX_18: M1.161(GPIO1_B0/SPI1_TXD_(1.8)) ; port SPI1_TX_18
SPI_IRQ#_33: M1.183(GPIO3_B6/MAC_RXCLK/UART3_RX_(3.3)) R49.2 ; port SPI_IRQ#_33
TYPEC0_D_N: M1.105(TYPEC0_DM) ; port TYPEC0_D_N
TYPEC0_D_P: M1.106(TYPEC0_DP) ; port TYPEC0_D_P
TYPEC0_SBU1_DC: M1.93(TYPEC0_SBU1_DC) ; port TYPEC0_SBU1_DC
TYPEC0_SBU2_DC: M1.94(TYPEC0_SBU2_DC) ; port TYPEC0_SBU2_DC
TYPEC0_SBU_N: M1.95(TYPEC0_SBU2) ; port TYPEC0_SBU_N
TYPEC0_SBU_P: M1.96(TYPEC0_SBU1) ; port TYPEC0_SBU_P
TYPEC0_U2VBUSDET: M1.111(TYPEC0_U2VBUSDET) ; port TYPEC0_U2VBUSDET
USB20_D_N: M1.116(HOST0_DM) ; port USB20_D_N
USB20_D_P: M1.117(HOST0_DP) ; port USB20_D_P
USB20_PWEN_30: M1.32(GPIO4_D3_(3.0)) ; port USB20_PWEN_30
USB21_D_N: M1.118(HOST1_DM) ; port USB21_D_N
USB21_D_P: M1.119(HOST1_DP) ; port USB21_D_P
USB21_PWEN_30: M1.31(GPIO4_D1_(3.0)) ; port USB21_PWEN_30
WLAN_IRQ_18: M1.168(GPIO1_C6_(1.8)) ; port WLAN_IRQ_18
WLAN_REG_EN_30: M1.30(GPIO4_D6_(3.0)) ; port WLAN_REG_EN_30
WLAN_SDIO_CLK_18: M1.24(GPIO2_D1/SDIO0_CLK_(1.8)) ; port WLAN_SDIO_CLK_18
WLAN_SDIO_CMD_18: M1.23(GPIO2_D0/SDIO0_CMD_(1.8)) ; port WLAN_SDIO_CMD_18
WLAN_SDIO_D0_18: M1.19(GPIO2_C4/SDIO0_D0/SPI5_RXD_(1.8)) ; port WLAN_SDIO_D0_18
WLAN_SDIO_D1_18: M1.20(GPIO2_C5/SDIO0_D1/SPI5_TXD_(1.8)) ; port WLAN_SDIO_D1_18
WLAN_SDIO_D2_18: M1.21(GPIO2_C6/SDIO0_D2/SPI5_CLK_(1.8)) ; port WLAN_SDIO_D2_18
WLAN_SDIO_D3_18: M1.22(GPIO2_C7/SDIO0_D3/SPI5_CSn0_(1.8)) ; port WLAN_SDIO_D3_18
NetM1_5: M1.5(GPIO4_A4/I2S1_LRCKI_(1.8)) R52.1
NetM1_50: M1.50(VCC_CHAREG_EN) R53.2 TP5.1

Not connected (* = marked no-connect by the designer): M1 16(GPIO3_D5/I2S0_SDO2_(1.8)) 18(ADC_IN2_(1.8)) 33(GPIO4_C6/PWM1_(3.0)) 36(MIPI_CAMERA_RST#__(1.8)) 43(GPIO4_C5/SPDIF_TX_(3.0)) 48(GPIO4_C7/HDMI_CEC_(3.0)) 54(MIPI_TX1/RX1_D0N) 55(MIPI_TX1/RX1_D0P) 56(MIPI_TX1/RX1_D1N) 57(MIPI_TX1/RX1_D1P) 58(MIPI_TX1/RX1_CLKN) 59(MIPI_TX1/RX1_CLKP) 60(MIPI_TX1/RX1_D2N) 61(MIPI_TX1/RX1_D2P) 62(MIPI_TX1/RX1_D3N) 63(MIPI_TX1/RX1_D3P) 64(MIPI_RX0_D3N) 65(MIPI_RX0_D3P) 66(MIPI_RX0_D2N) 67(MIPI_RX0_D2P) 68(MIPI_RX0_CLKN) 69(MIPI_RX0_CLKP) 70(MIPI_RX0_D1N) 71(MIPI_RX0_D1P) 72(MIPI_RX0_D0N) 73(MIPI_RX0_D0P) 97(TYPEC0_RX1N) 98(TYPEC0_RX1P) 99(TYPEC0_TX1P) 100(TYPEC0_TX1N) 101(TYPEC0_RX2N) 102(TYPEC0_RX2N) 103(TYPEC0_TX2P) 104(TYPEC0_TX2N) 107(USB3_SSTXP) 108(USB3_SSTXN) 109(USB3_SSRXP) 110(USB3_SSRXN) 113(ADC_IN0_(1.8)) 114(USB3_DM) 115(USB3_DP) 124(GPIO0_B2_(1.8)) 125(GPIO0_B1_(1.8)) 126(GPIO0_A3_(1.8)) 135(EDP_TX3P) 136(EDP_TX3N) 137(EDP_TX2P) 138(EDP_TX2N) 139(EDP_TX1P) 140(EDP_TX1N) 141(EDP_TX0P) 142(EDP_TX0N) 143(EDPAUXP) 144(EDPAUXN) 145(GPIO4_D0_(3.0)) 146(GPIO0_B3_(1.8)) 147(GPIO0_B0_(1.8)) 148(GPIO1_A1_(1.8)) 149(GPIO1_A0_(1.8)) 152(GPIO0_A2/RK3399_26M_OUT_(1.8)) 153(GPIO0_B4_(1.8)) 154(GPIO0_B5_(1.8)) 155(GPIO0_A6/PWM3A_(1.8)) 156(GPIO1_C7_(1.8)) 157(GPIO1_A4_(1.8)) 158(GPIO1_A3_(1.8)) 159(GPIO1_B5_(1.8)) 160(GPIO1_A2_(1.8)) 165(GPIO1_C2/SPI3_CSn0_(1.8)) 166(GPIO1_C4/I2C8_SDA_(1.8)) 167(GPIO1_D0_(1.8)) 169(GPIO2_B3/SPI2_CLK/CIF_CLKO_(1.8)) 170(GPIO2_B0/I2C7_SCL/CIF_VSYNC_(1.8)) 171(GPIO2_A7/I2C7_SDA/CIF_D7_(1.8)) 172(GPIO2_A6/CIF_D6_(1.8)) 173(GPIO2_A5/CIF_D5_(1.8)) 174(GPIO2_A4/CIF_D4_(1.8)) 175(GPIO2_A3/CIF_D3_(1.8)) 176(GPIO2_A2/CIF_D2_(1.8)) 177(GPIO2_A1/I2C2_SCL/CIF_D1_(1.8)) 178(GPIO2_A0/I2C2_SDA/CIF_D0_(1.8)) 179(GPIO2_B4/SPI2_CSn0_(1.8)) 180(GPIO2_B1/I2C6_SDA/CIF_HREF_(1.8)) 181(GPIO2_B2/I2C6_SCL/CIF_CLKI_(1.8)) 185(GPIO3_B0/MAC_MDC/SPI0_CSn1_(3.3)) 186(GPIO3_A3/MAC_RXD3/SPI4_CSn0_(3.3)) 187(GPIO3_A2/MAC_RXD2/SPI4_CLK_(3.3)) 188(GPIO3_A7/MAC_RXD1/SPI0_CSn0_(3.3)) 189(GPIO3_A6/MAC_RXD0/SPI0_CLK_(3.3)) 190(GPIO3_C0/MAC_COL/UART3_CTSn/SPDIF_TX_(3.3)) 191(GPIO3_C1/MAC_TXCLK/UART3_RTSn_(3.3)) 193(GPIO3_B7/MAC_CRS/UART3_TX_(3.3)) 194(GPIO3_A4/MAC_TXD0/SPI0_RXD_(3.3)) 195(GPIO3_A5/MAC_TXD1/SPI0_TXD_(3.3)) 196(GPIO3_A0/MAC_TXD2/SPI4_RXD_(3.3)) 197(GPIO3_A1/MAC_TXD3/SPI4_TXD_(3.3))

### Layout directives
mark named 100mA: 1V8_S3

### Library data of the parts
C44-C51 = CAP_NPOL
D4 = SHOTTKY
M1 = X3399-CORE: RK3399 Six-Core 64-bit
P2 = HDR 3: Header, 3-Pin; LatestRevisionDate: 17-Jul-2002; LatestRevisionNote: Re-released for DXP Platform.; Publisher: Altium Limited
R47-R54 = RESISTOR: RES
  R47 R48: Value: 4.7k
  R49 R54: Value: 10k
  R50 R51 R53: Value: 1k
  R52: Value: 24
SW1-SW3 = SW tact 2-pin: Microswitches, DTSMB-3 series; Value: SW tact 2-pin
TP4 TP5 = TEST-POINT: PCB terminal block; Value: *